# Altium project RGV_PCBA_1V21.PrjPcb (part 2 of 2)

## Sheet 9_USB_Connectors.SchDoc: Apalis Evaluation Board 1.1
size A3; Organization: Toradex AG; Address1: Altsagenstrasse 5; Address2: Horw; Address3: 6048; Address4: Switzerland; DocumentNumber: 7; Revision: V1.1; SheetNumber: 7; SheetTotal: 32; PageSetup: Record=PageOptions|CenterHorizontal=True|CenterVertical=True|PrintScale=0.71|XCorrection=1.00|YCorrection=1.00|PrintKind=0|BorderSize=5000000|LeftOffset=0|BottomOffset=0|Orientation=2|PaperLength=1000|PaperWidth=1000|Scale=100|PaperSource=7|PrintQuality=-4|MediaType=1|DitherType=10|PaperKind=A4|PrintScaleMode=1
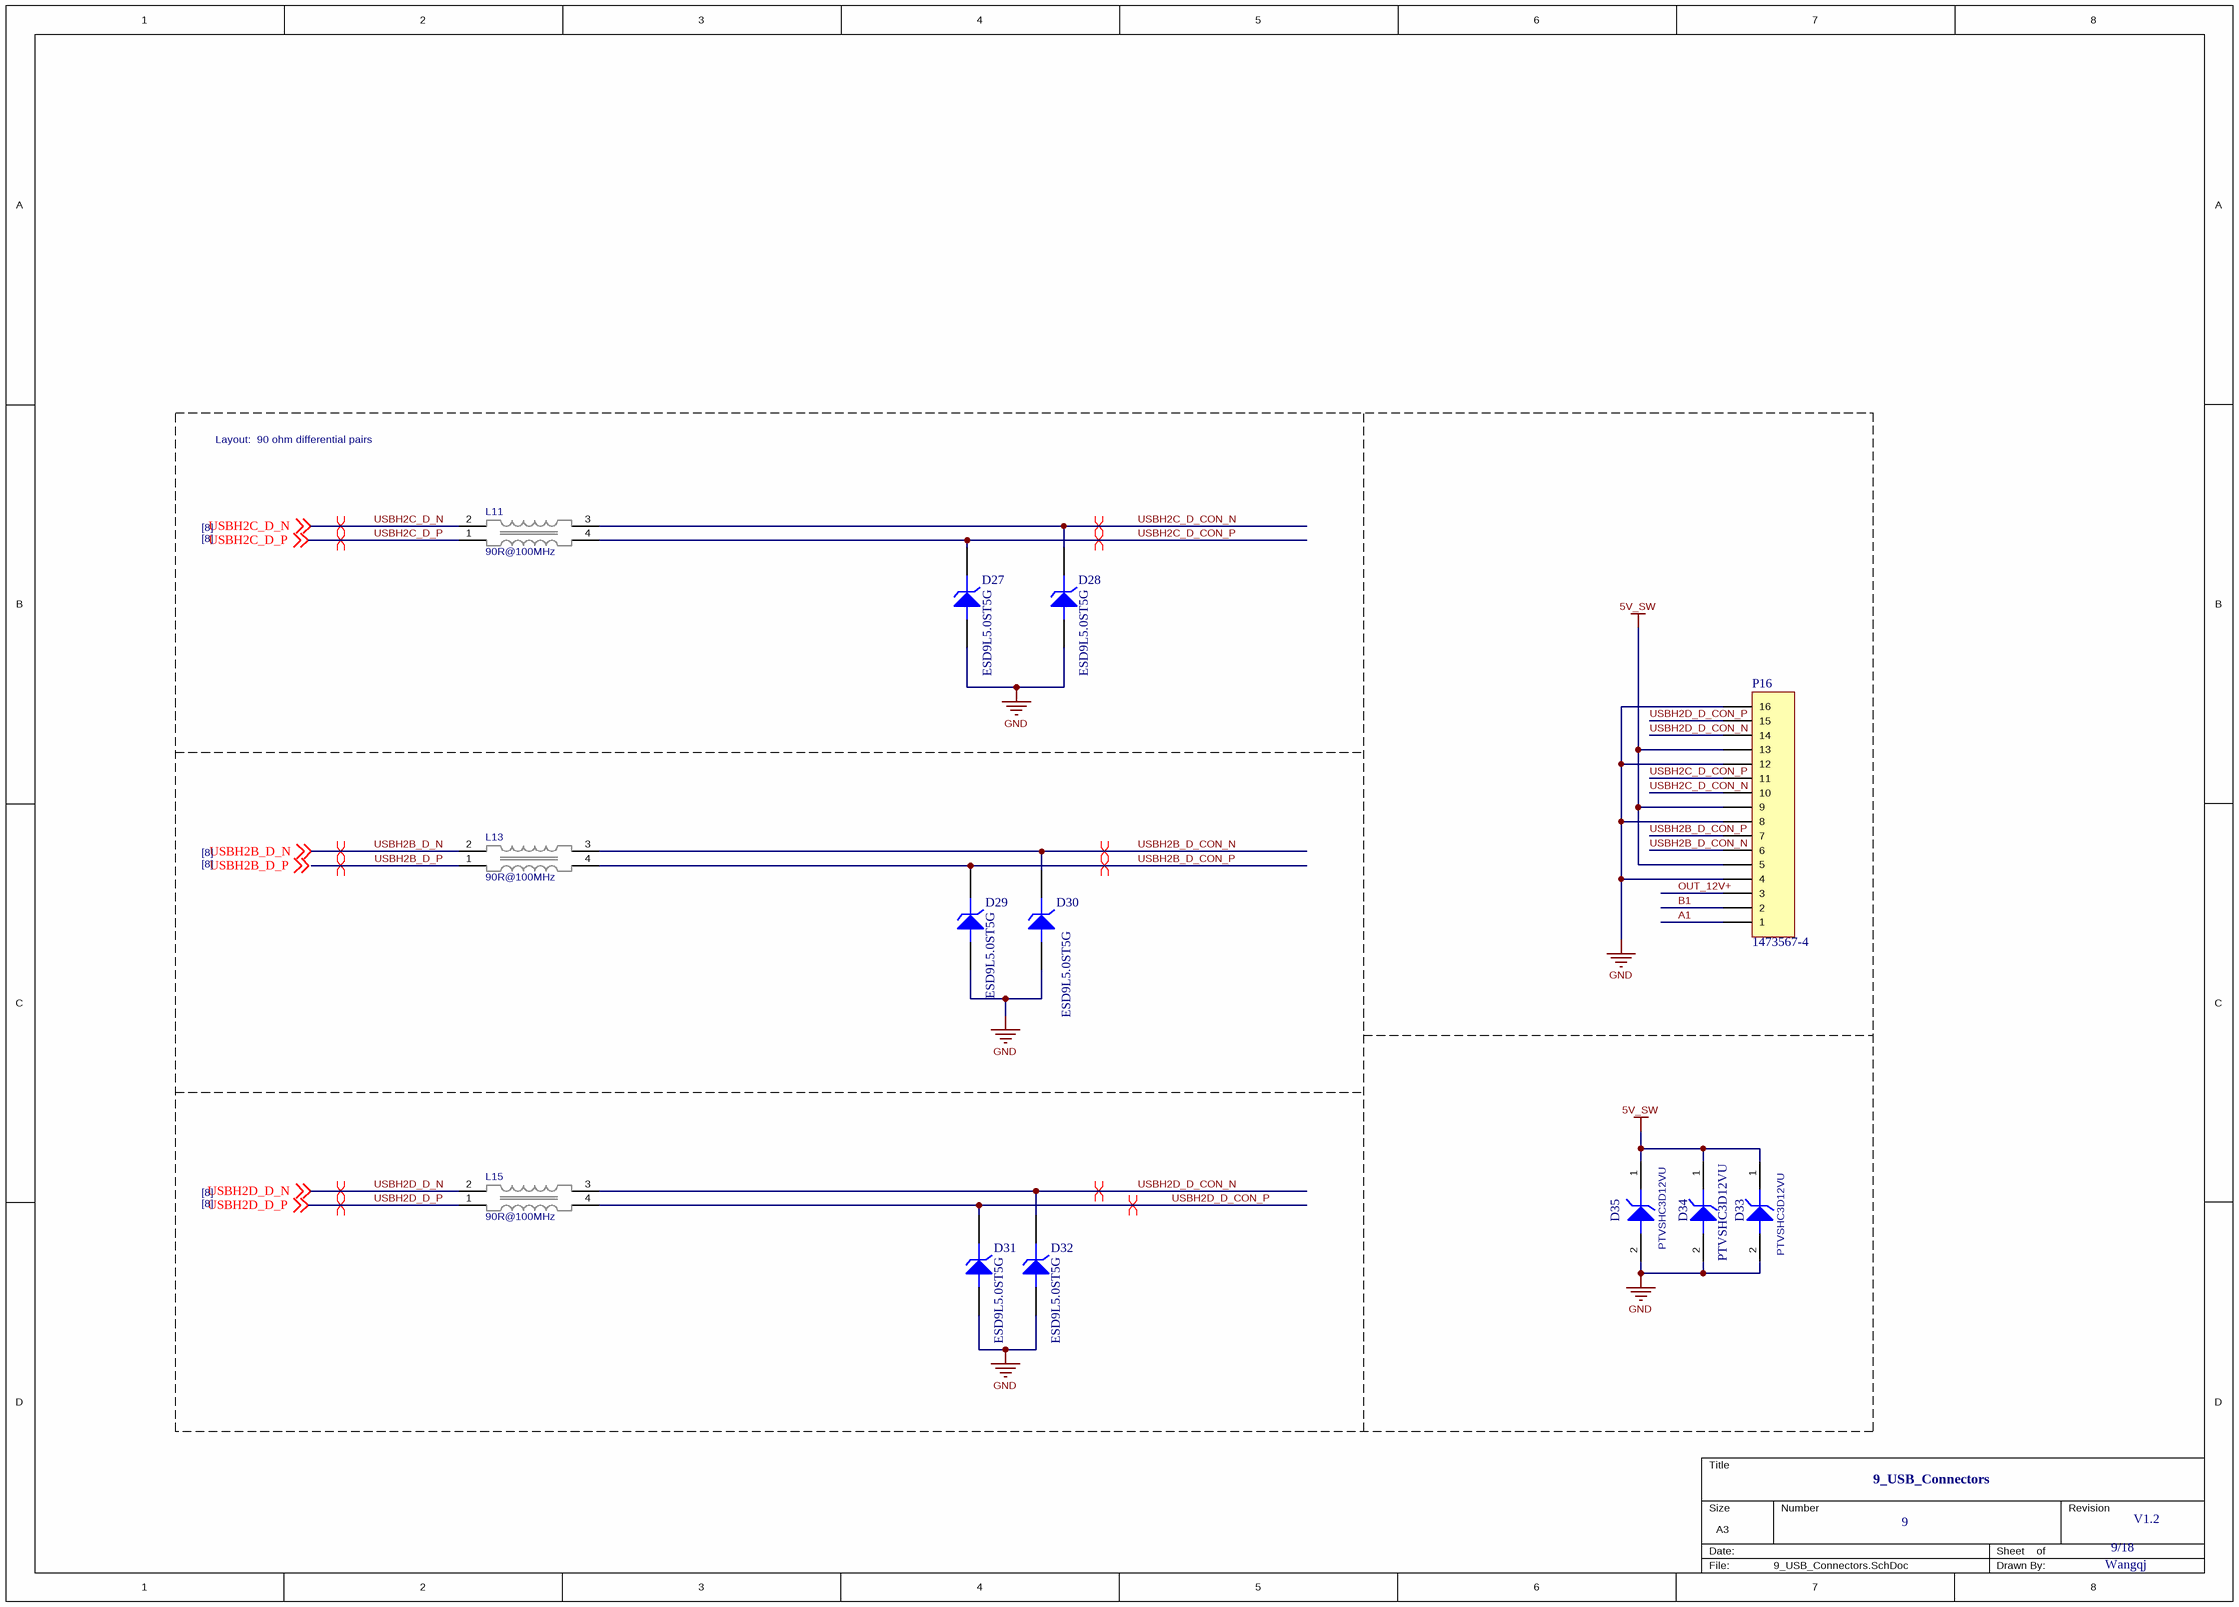
[diagram p8: 9_USB_Connectors.SchDoc]

### Parts
D27  ESD9L5.0ST5G  [LC-SOD-923]
D28  ESD9L5.0ST5G  [LC-SOD-923]
D29  ESD9L5.0ST5G  [LC-SOD-923]
D30  ESD9L5.0ST5G  [LC-SOD-923]
D31  ESD9L5.0ST5G  [LC-SOD-923]
D32  ESD9L5.0ST5G  [LC-SOD-923]
D33  PTVSHC3D12VU  [LC-SOD-323]
D34  PTVSHC3D12VU  [LC-SOD-323]
D35  PTVSHC3D12VU  [LC-SOD-323]
L11  90R@100MHz  [T_Murata_DLW21SN900SQ2]
L13  90R@100MHz  [T_Murata_DLW21SN900SQ2]
L15  90R@100MHz  [T_Murata_DLW21SN900SQ2]
P16  1473567-4  [147-4]

### Nets
5V_SW: D33.1(K) D34.1(K) D35.1(K) P16.5 P16.9 P16.13
GND: D27.1(A) D28.1(A) D29.1(A) D30.1(A) D31.1(A) D32.1(A) D33.2(A) D34.2(A) D35.2(A) P16.4 P16.8 P16.12 P16.16
OUT_12V+: P16.3
A1: P16.1
B1: P16.2
USBH2B_D_CON_N: D30.2(K) L13.3 P16.6
USBH2B_D_CON_P: D29.2(K) L13.4 P16.7
USBH2B_D_N: L13.2 ; off-sheet USBH2B_D_N
USBH2B_D_P: L13.1 ; off-sheet USBH2B_D_P
USBH2C_D_CON_N: D28.2(K) L11.3 P16.10
USBH2C_D_CON_P: D27.2(K) L11.4 P16.11
USBH2C_D_N: L11.2 ; off-sheet USBH2C_D_N
USBH2C_D_P: L11.1 ; off-sheet USBH2C_D_P
USBH2D_D_CON_N: D32.2(K) L15.3 P16.14
USBH2D_D_CON_P: D31.2(K) L15.4 P16.15
USBH2D_D_N: L15.2 ; off-sheet USBH2D_D_N
USBH2D_D_P: L15.1 ; off-sheet USBH2D_D_P

### Layout directives
differential pair: USBH2B_D_CON_N, USBH2B_D_CON_P, USBH2B_D_N, USBH2B_D_P, USBH2C_D_CON_N, USBH2C_D_CON_P, USBH2C_D_N, USBH2C_D_P, USBH2D_D_CON_N, USBH2D_D_CON_P, USBH2D_D_N, USBH2D_D_P

### Notes on the sheet
- Layout:  90 ohm differential pairs
- [8]
- 9_USB_Connectors
- 9
- 9/18
- V1.2
- Wangqj
- Labels drawn without touching a wire or pin: USBH2B_D_P
- Title
- Size:
- Date:
- A3
- Number:
- Time:
- Revision:
- Sheet
- of
- File:

### Library data of the parts
D27-D32 = ZENER3: TVS Diode
D33-D35 = Diode_TVS: TVS Diode
L11 L13 L15 = L-Murata-DLW21SN900SQ2-90R@100MHz-330mA-25%: Common Mode Choke High Speed 90R 330mA; Manufacturer Name: Murata; Tolerance: 25%; Rating: 330mA; Manufacturer Part No.: DLW21SN900SQ2; Value: 90R@100MHz
P16 = Header 16H: 泰科4p端子; LatestRevisionDate: 17-Jul-2002; LatestRevisionNote: Re-released for DXP Platform.; Publisher: Altium Limited

## Sheet 10_RS232_1.SchDoc
size A3
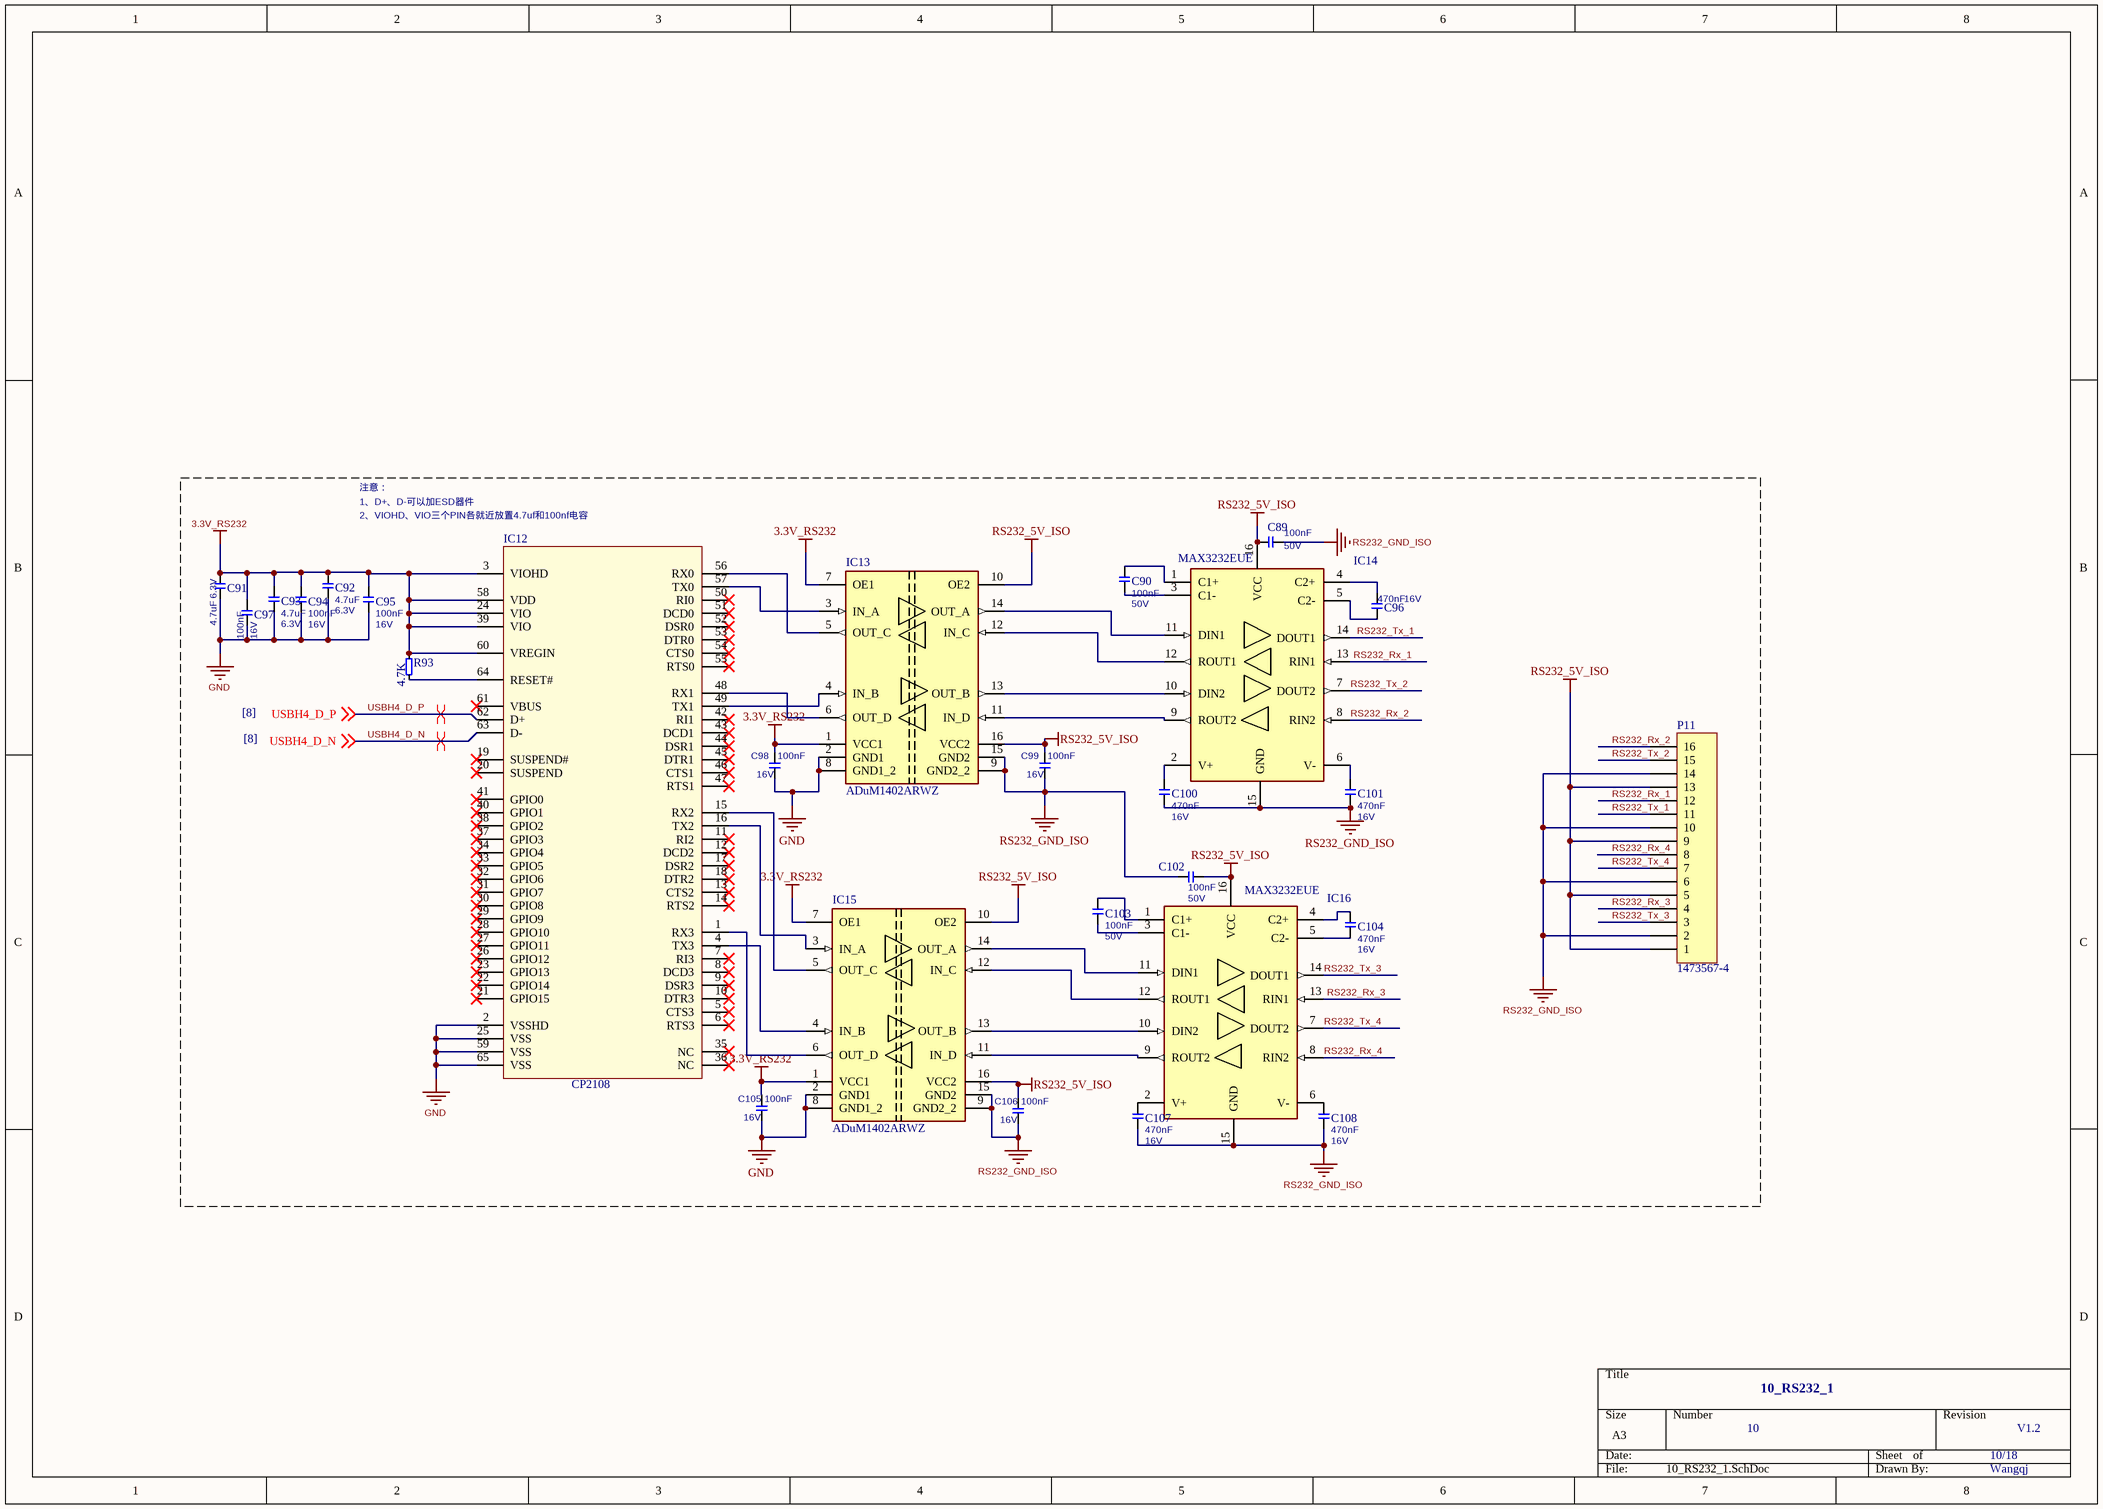
[diagram p9: 10_RS232_1.SchDoc]

### Parts
C89  Rating: 50V  [T_CAPC0603X33N]  (hidden comment: 100nF)
C90  Rating: 50V  [T_CAPC0603X33N]  (hidden comment: 100nF)
C91  Rating: 6.3V  [T_CAPC0603X33N]  (hidden comment: 4.7uF)
C92  Rating: 6.3V  [T_CAPC0603X33N]  (hidden comment: 4.7uF)
C93  Rating: 6.3V  [T_CAPC0603X33N]  (hidden comment: 4.7uF)
C94  Rating: 16V  [T_CAPC0603X33N]  (hidden comment: 100nF)
C95  Rating: 16V  [T_CAPC0603X33N]  (hidden comment: 100nF)
C96  Rating: 16V  [T_CAPC0603X33N]  (hidden comment: 470nF)
C97  Rating: 16V  [T_CAPC0603X33N]  (hidden comment: 100nF)
C98  Rating: 16V  [T_CAPC0603X33N]  (hidden comment: 100nF)
C99  Rating: 16V  [T_CAPC0603X33N]  (hidden comment: 100nF)
C100  Rating: 16V  [T_CAPC0603X33N]  (hidden comment: 470nF)
C101  Rating: 16V  [T_CAPC0603X33N]  (hidden comment: 470nF)
C102  Rating: 50V  [T_CAPC0603X33N]  (hidden comment: 100nF)
C103  Rating: 50V  [T_CAPC0603X33N]  (hidden comment: 100nF)
C104  Rating: 16V  [T_CAPC0603X33N]  (hidden comment: 470nF)
C105  Rating: 16V  [T_CAPC0603X33N]  (hidden comment: 100nF)
C106  Rating: 16V  [T_CAPC0603X33N]  (hidden comment: 100nF)
C107  Rating: 16V  [T_CAPC0603X33N]  (hidden comment: 470nF)
C108  Rating: 16V  [T_CAPC0603X33N]  (hidden comment: 470nF)
IC12  CP2108  [QFN50P900X900X90_HS-65N]
IC13  ADuM1402ARWZ  [T_AD_ADuM1300ARW]
IC14  MAX3232EUE  [LC-TSSOP-16]
IC15  ADuM1402ARWZ  [T_AD_ADuM1300ARW]
IC16  MAX3232EUE  [LC-TSSOP-16]
P11  1473567-4  [147-4]
R93  4.7K  [t_RESC0603X30N]

### Nets
3.3V_RS232: C91.2 C92.2 C93.2 C94.2 C95.2 C97.2 C98.2 C105.2 IC12.3(VIOHD) IC12.24(VIO) IC12.39(VIO) IC12.58(VDD) IC12.60(VREGIN) IC13.1(VCC1) IC13.7(OE1) IC15.1(VCC1) IC15.7(OE1) R93.2
GND: C91.1 C92.1 C93.1 C94.1 C95.1 C97.1 C98.1 C105.1 IC12.2(VSSHD) IC12.25(VSS) IC12.59(VSS) IC12.65(VSS) IC13.2(GND1) IC13.8(GND1_2) IC15.2(GND1) IC15.8(GND1_2)
RS232_5V_ISO: C89.2 C99.2 C102.1 C106.2 IC13.10(OE2) IC13.16(VCC2) IC14.16(VCC) IC15.10(OE2) IC15.16(VCC2) IC16.16(VCC) P11.1 P11.5 P11.9 P11.13
RS232_GND_ISO: C89.1 C99.1 C100.1 C101.1 C102.2 C106.1 C107.1 C108.1 IC13.9(GND2_2) IC13.15(GND2) IC14.15(GND) IC15.9(GND2_2) IC15.15(GND2) IC16.15(GND) P11.2 P11.6 P11.10 P11.14
RS232_Rx_1: IC14.13(RIN1) P11.12
RS232_Rx_2: IC14.8(RIN2) P11.16
RS232_Rx_3: IC16.13(RIN1) P11.4
RS232_Rx_4: IC16.8(RIN2) P11.8
RS232_Tx_1: IC14.14(DOUT1) P11.11
RS232_Tx_2: IC14.7(DOUT2) P11.15
RS232_Tx_3: IC16.14(DOUT1) P11.3
RS232_Tx_4: IC16.7(DOUT2) P11.7
USBH4_D_N: IC12.63(D-) ; off-sheet USBH4_D_N
USBH4_D_P: IC12.62(D+) ; off-sheet USBH4_D_P
NetC90_1: C90.1 IC14.3(C1-)
NetC90_2: C90.2 IC14.1(C1+)
NetC96_1: C96.1 IC14.5(C2-)
NetC96_2: C96.2 IC14.4(C2+)
NetC100_2: C100.2 IC14.2(V+)
NetC101_2: C101.2 IC14.6(V-)
NetC103_1: C103.1 IC16.3(C1-)
NetC103_2: C103.2 IC16.1(C1+)
NetC104_1: C104.1 IC16.5(C2-)
NetC104_2: C104.2 IC16.4(C2+)
NetC107_2: C107.2 IC16.2(V+)
NetC108_2: C108.2 IC16.6(V-)
NetIC12_1: IC12.1(RX3) IC15.6(OUT_D)
NetIC12_4: IC12.4(TX3) IC15.4(IN_B)
NetIC12_15: IC12.15(RX2) IC15.5(OUT_C)
NetIC12_16: IC12.16(TX2) IC15.3(IN_A)
NetIC12_48: IC12.48(RX1) IC13.6(OUT_D)
NetIC12_49: IC12.49(TX1) IC13.4(IN_B)
NetIC12_56: IC12.56(RX0) IC13.5(OUT_C)
NetIC12_57: IC12.57(TX0) IC13.3(IN_A)
NetIC12_64: IC12.64(RESET#) R93.1
NetIC13_11: IC13.11(IN_D) IC14.9(ROUT2)
NetIC13_12: IC13.12(IN_C) IC14.12(ROUT1)
NetIC13_13: IC13.13(OUT_B) IC14.10(DIN2)
NetIC13_14: IC13.14(OUT_A) IC14.11(DIN1)
NetIC15_11: IC15.11(IN_D) IC16.9(ROUT2)
NetIC15_12: IC15.12(IN_C) IC16.12(ROUT1)
NetIC15_13: IC15.13(OUT_B) IC16.10(DIN2)
NetIC15_14: IC15.14(OUT_A) IC16.11(DIN1)

Not connected (* = marked no-connect by the designer): IC12 5(CTS3)* 6(RTS3)* 7(RI3)* 8(DCD3)* 9(DSR3)* 10(DTR3)* 11(RI2)* 12(DCD2)* 13(CTS2)* 14(RTS2)* 17(DSR2)* 18(DTR2)* 19(SUSPEND#)* 20(SUSPEND)* 21(GPIO15)* 22(GPIO14)* 23(GPIO13)* 26(GPIO12)* 27(GPIO11)* 28(GPIO10)* 29(GPIO9)* 30(GPIO8)* 31(GPIO7)* 32(GPIO6)* 33(GPIO5)* 34(GPIO4)* 35(NC)* 36(NC)* 37(GPIO3)* 38(GPIO2)* 40(GPIO1)* 41(GPIO0)* 42(RI1)* 43(DCD1)* 44(DSR1)* 45(DTR1)* 46(CTS1)* 47(RTS1)* 50(RI0)* 51(DCD0)* 52(DSR0)* 53(DTR0)* 54(CTS0)* 55(RTS0)* 61(VBUS)*

### Layout directives
differential pair: USBH4_D_N, USBH4_D_P

### Notes on the sheet
- 注意：
- 1、D+、D-可以加ESD器件
- 2、VIOHD、VIO三个PIN各就近放置4.7uf和100nf电容
- [8]
- 10_RS232_1
- 10
- 10/18
- V1.2
- Wangqj

### Library data of the parts
C89 C90 C102 C103 = C-X7R-100nF-50V-20%-0603: Capacitor Ceramic X7R 100nF 50V 20% 0603; Tolerance: 20%; Type: X7R; Value: 100nF
C91-C93 = C-4.7uF-6.3V-20%-0603-X5R: Capacitor Ceramic X5R 4.7uF 6.3V 20% 0603; Tolerance: 20%; Type: X5R; Value: 4.7uF
C94 C95 C97 = C-100nF-16V-10%-0603-X7R: Capacitor Ceramic X7R 100nF 16V 10% 0603; Tolerance: 10%; Type: X7R; Value: 100nF
C96 C100 C101 C104 C107 C108 = C-X7R-470nF-16V-10%-0603: Capacitor Ceramic X7R 470nF 16V 10% 0603; Type: X7R; Tolerance: 10%; Value: 470nF
C98 C99 C105 C106 = C-X7R-100nF-16V-10%-0603: Capacitor Ceramic X7R 100nF 16V 10% 0603; Tolerance: 10%; Type: X7R; Value: 100nF
IC12 = IC-SILICON-CP2108: Single-Chip USB To Quad UART Bridge; Manufacturer Name: SILICON LABS; Manucfacturer Part NO.: CP2108
IC13 IC15 = IC-AD-ADuM1402ARWZ: Digital Isolator
IC14 IC16 = IC-MAXIM-MAX3232: RS232
P11 = MHDR1X16: 泰科4P端子; LatestRevisionDate: 17-Jul-2002; LatestRevisionNote: Re-released for DXP Platform.; Publisher: Altium Limited
R93 = R-4.7kR-63mW-5%-0603: Resistor 4.7 Kohm 63mW 5% 0603; Value: 4.7KR; Rating: 63mW; Tolerance: 5%

## Sheet 11_RS232_2.SchDoc
size A3
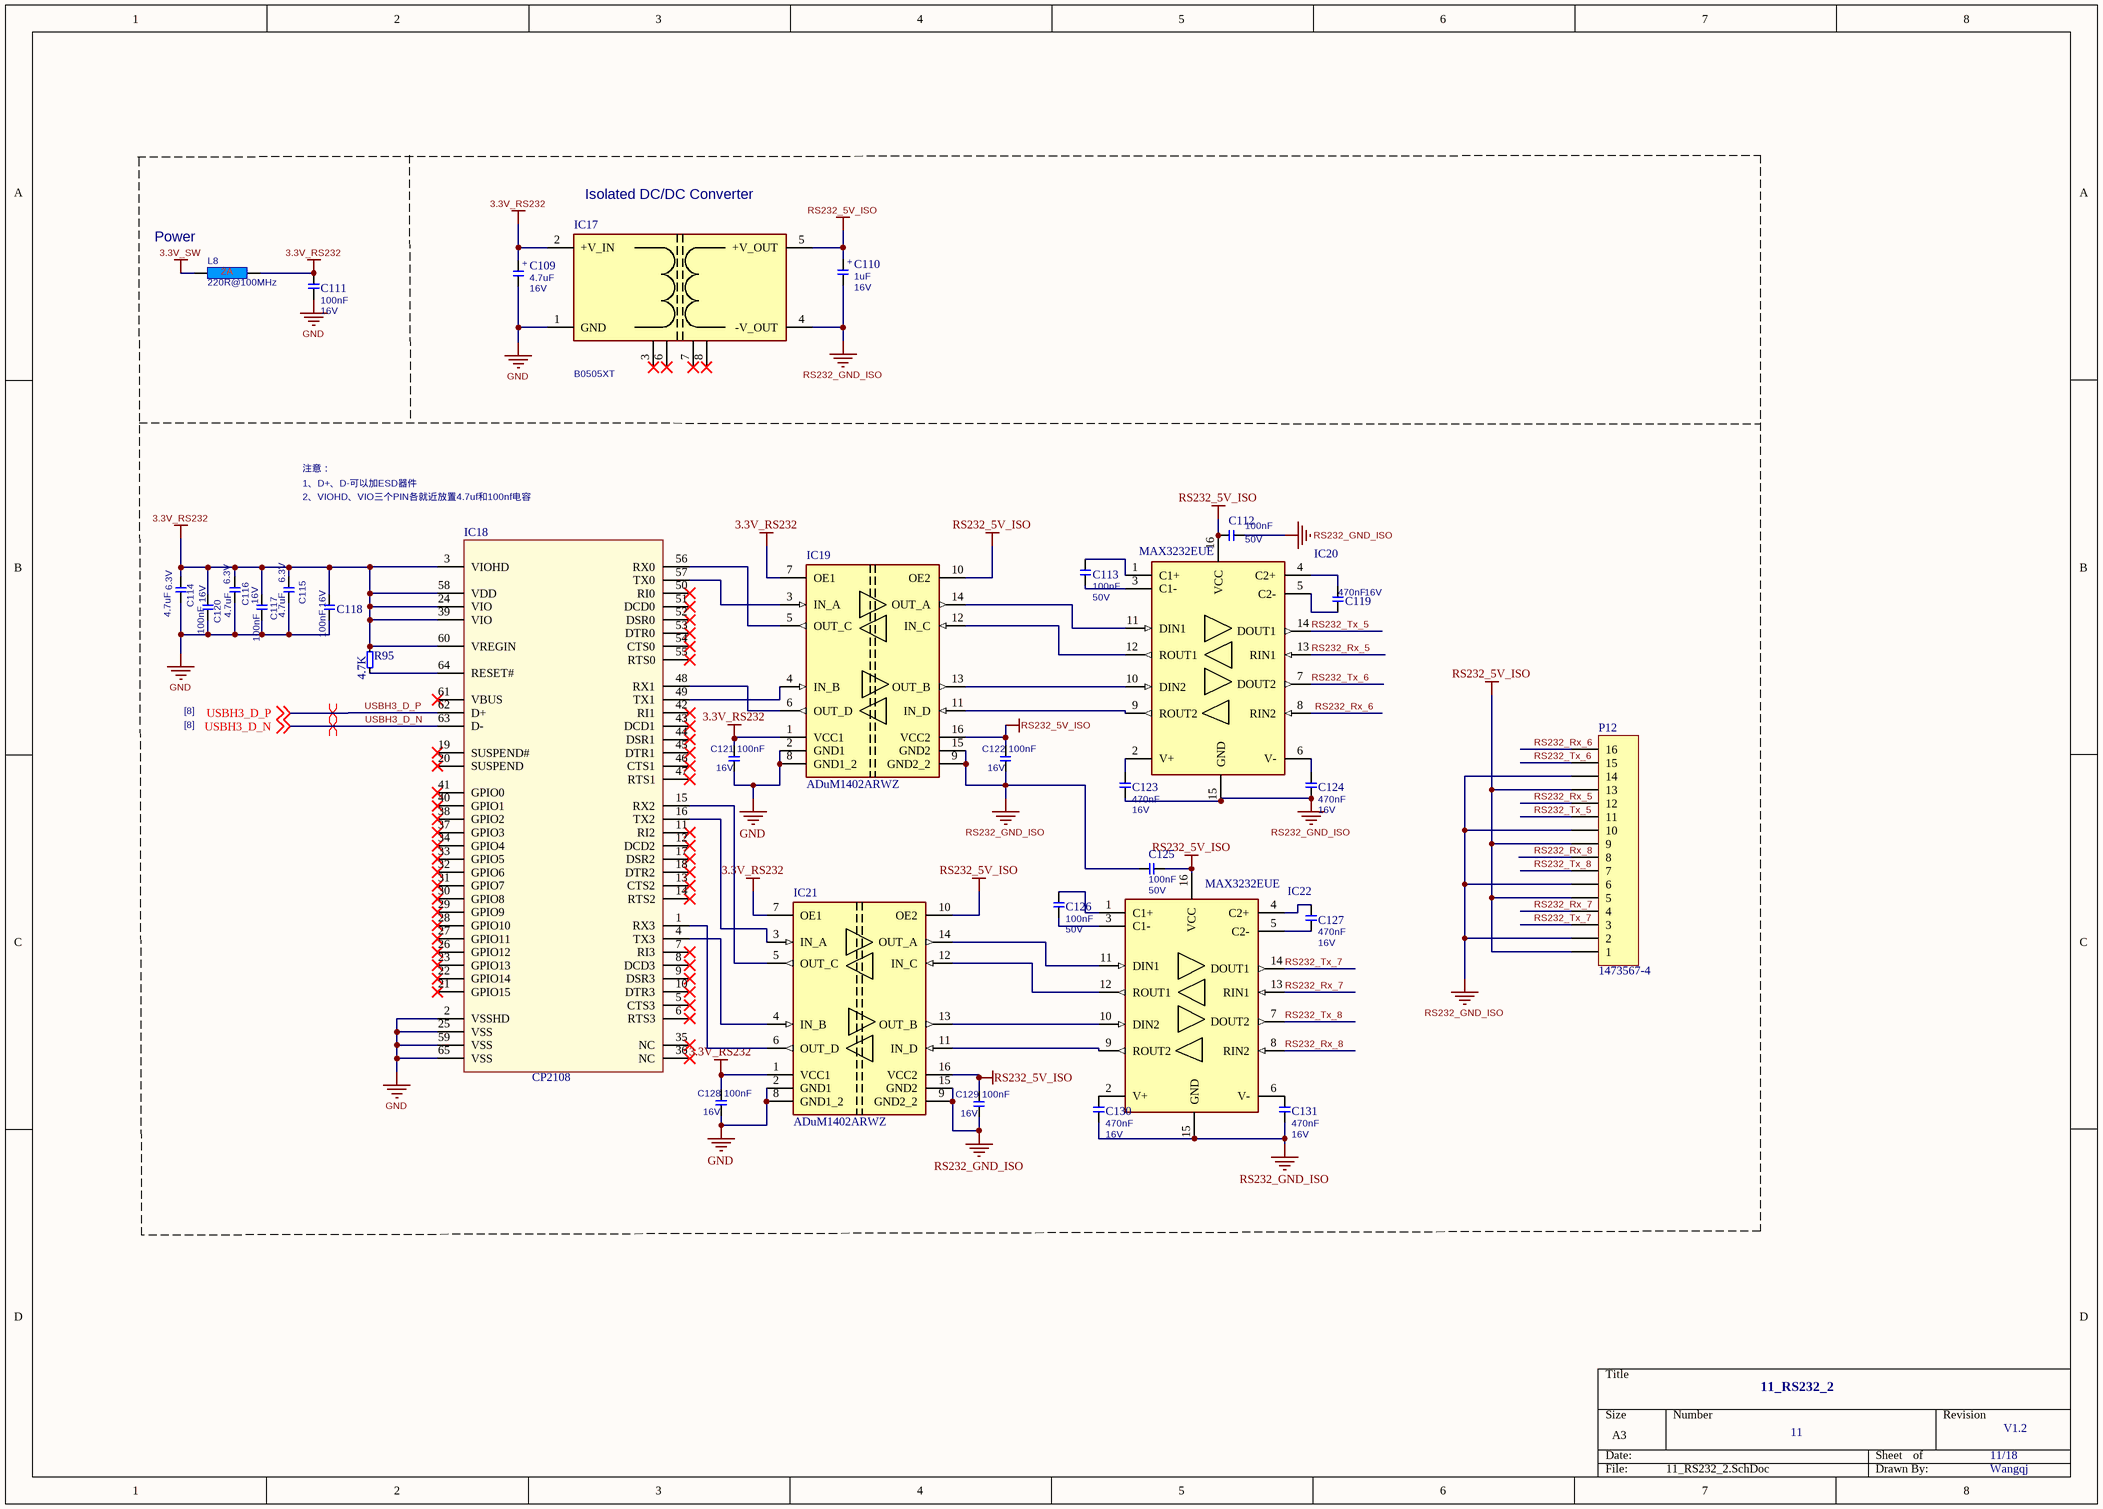
[diagram p10: 11_RS232_2.SchDoc]

### Parts
C109  Rating: 16V  [T_CAPMP3216X180N]  (hidden comment: 4.7uF)
C110  Rating: 16V  [T_CAPMP3216X180N]  (hidden comment: 1uF)
C111  Rating: 16V  [T_CAPC0603X33N]  (hidden comment: 100nF)
C112  Rating: 50V  [T_CAPC0603X33N]  (hidden comment: 100nF)
C113  Rating: 50V  [T_CAPC0603X33N]  (hidden comment: 100nF)
C114  Rating: 6.3V  [T_CAPC0603X33N]  (hidden comment: 4.7uF)
C115  Rating: 6.3V  [T_CAPC0603X33N]  (hidden comment: 4.7uF)
C116  Rating: 6.3V  [T_CAPC0603X33N]  (hidden comment: 4.7uF)
C117  Rating: 16V  [T_CAPC0603X33N]  (hidden comment: 100nF)
C118  Rating: 16V  [T_CAPC0603X33N]  (hidden comment: 100nF)
C119  Rating: 16V  [T_CAPC0603X33N]  (hidden comment: 470nF)
C120  Rating: 16V  [T_CAPC0603X33N]  (hidden comment: 100nF)
C121  Rating: 16V  [T_CAPC0603X33N]  (hidden comment: 100nF)
C122  Rating: 16V  [T_CAPC0603X33N]  (hidden comment: 100nF)
C123  Rating: 16V  [T_CAPC0603X33N]  (hidden comment: 470nF)
C124  Rating: 16V  [T_CAPC0603X33N]  (hidden comment: 470nF)
C125  Rating: 50V  [T_CAPC0603X33N]  (hidden comment: 100nF)
C126  Rating: 50V  [T_CAPC0603X33N]  (hidden comment: 100nF)
C127  Rating: 16V  [T_CAPC0603X33N]  (hidden comment: 470nF)
C128  Rating: 16V  [T_CAPC0603X33N]  (hidden comment: 100nF)
C129  Rating: 16V  [T_CAPC0603X33N]  (hidden comment: 100nF)
C130  Rating: 16V  [T_CAPC0603X33N]  (hidden comment: 470nF)
C131  Rating: 16V  [T_CAPC0603X33N]  (hidden comment: 470nF)
IC17  Manufacturer Part No.: B0505XT  [MORNSUN_B0305XT-1W_SMD]  (hidden comment: B0505XT-1W)
IC18  CP2108  [QFN50P900X900X90_HS-65N]
IC19  ADuM1402ARWZ  [T_AD_ADuM1300ARW]
IC20  MAX3232EUE  [LC-TSSOP-16]
IC21  ADuM1402ARWZ  [T_AD_ADuM1300ARW]
IC22  MAX3232EUE  [LC-TSSOP-16]
L8  220R@100MHz  [INDC1608X95N]
P12  1473567-4  [147-4]
R95  4.7K  [t_RESC0603X30N]

### Nets
3.3V_RS232: C109.1 C111.2 C114.2 C115.2 C116.2 C117.2 C118.2 C120.2 C121.2 C128.2 IC17.2(+V_IN) IC18.3(VIOHD) IC18.24(VIO) IC18.39(VIO) IC18.58(VDD) IC18.60(VREGIN) IC19.1(VCC1) IC19.7(OE1) IC21.1(VCC1) IC21.7(OE1) L8.2 R95.2
3.3V_SW: L8.1
GND: C109.2 C111.1 C114.1 C115.1 C116.1 C117.1 C118.1 C120.1 C121.1 C128.1 IC17.1(GND) IC18.2(VSSHD) IC18.25(VSS) IC18.59(VSS) IC18.65(VSS) IC19.2(GND1) IC19.8(GND1_2) IC21.2(GND1) IC21.8(GND1_2)
RS232_5V_ISO: C110.1 C112.2 C122.2 C125.1 C129.2 IC17.5(+V_OUT) IC19.10(OE2) IC19.16(VCC2) IC20.16(VCC) IC21.10(OE2) IC21.16(VCC2) IC22.16(VCC) P12.1 P12.5 P12.9 P12.13
RS232_GND_ISO: C110.2 C112.1 C122.1 C123.1 C124.1 C125.2 C129.1 C130.1 C131.1 IC17.4(-V_OUT) IC19.9(GND2_2) IC19.15(GND2) IC20.15(GND) IC21.9(GND2_2) IC21.15(GND2) IC22.15(GND) P12.2 P12.6 P12.10 P12.14
RS232_Rx_5: IC20.13(RIN1) P12.12
RS232_Rx_6: IC20.8(RIN2) P12.16
RS232_Rx_7: IC22.13(RIN1) P12.4
RS232_Rx_8: IC22.8(RIN2) P12.8
RS232_Tx_5: IC20.14(DOUT1) P12.11
RS232_Tx_6: IC20.7(DOUT2) P12.15
RS232_Tx_7: IC22.14(DOUT1) P12.3
RS232_Tx_8: IC22.7(DOUT2) P12.7
USBH3_D_N: IC18.63(D-) ; off-sheet USBH3_D_N
USBH3_D_P: IC18.62(D+) ; off-sheet USBH3_D_P
NetC113_1: C113.1 IC20.3(C1-)
NetC113_2: C113.2 IC20.1(C1+)
NetC119_1: C119.1 IC20.5(C2-)
NetC119_2: C119.2 IC20.4(C2+)
NetC123_2: C123.2 IC20.2(V+)
NetC124_2: C124.2 IC20.6(V-)
NetC126_1: C126.1 IC22.3(C1-)
NetC126_2: C126.2 IC22.1(C1+)
NetC127_1: C127.1 IC22.5(C2-)
NetC127_2: C127.2 IC22.4(C2+)
NetC130_2: C130.2 IC22.2(V+)
NetC131_2: C131.2 IC22.6(V-)
NetIC18_1: IC18.1(RX3) IC21.6(OUT_D)
NetIC18_4: IC18.4(TX3) IC21.4(IN_B)
NetIC18_15: IC18.15(RX2) IC21.5(OUT_C)
NetIC18_16: IC18.16(TX2) IC21.3(IN_A)
NetIC18_48: IC18.48(RX1) IC19.6(OUT_D)
NetIC18_49: IC18.49(TX1) IC19.4(IN_B)
NetIC18_56: IC18.56(RX0) IC19.5(OUT_C)
NetIC18_57: IC18.57(TX0) IC19.3(IN_A)
NetIC18_64: IC18.64(RESET#) R95.1
NetIC19_11: IC19.11(IN_D) IC20.9(ROUT2)
NetIC19_12: IC19.12(IN_C) IC20.12(ROUT1)
NetIC19_13: IC19.13(OUT_B) IC20.10(DIN2)
NetIC19_14: IC19.14(OUT_A) IC20.11(DIN1)
NetIC21_11: IC21.11(IN_D) IC22.9(ROUT2)
NetIC21_12: IC21.12(IN_C) IC22.12(ROUT1)
NetIC21_13: IC21.13(OUT_B) IC22.10(DIN2)
NetIC21_14: IC21.14(OUT_A) IC22.11(DIN1)

Not connected (* = marked no-connect by the designer): IC17 3(NC)* 6(NC)* 7(NC)* 8(NC)*; IC18 5(CTS3)* 6(RTS3)* 7(RI3)* 8(DCD3)* 9(DSR3)* 10(DTR3)* 11(RI2)* 12(DCD2)* 13(CTS2)* 14(RTS2)* 17(DSR2)* 18(DTR2)* 19(SUSPEND#)* 20(SUSPEND)* 21(GPIO15)* 22(GPIO14)* 23(GPIO13)* 26(GPIO12)* 27(GPIO11)* 28(GPIO10)* 29(GPIO9)* 30(GPIO8)* 31(GPIO7)* 32(GPIO6)* 33(GPIO5)* 34(GPIO4)* 35(NC)* 36(NC)* 37(GPIO3)* 38(GPIO2)* 40(GPIO1)* 41(GPIO0)* 42(RI1)* 43(DCD1)* 44(DSR1)* 45(DTR1)* 46(CTS1)* 47(RTS1)* 50(RI0)* 51(DCD0)* 52(DSR0)* 53(DTR0)* 54(CTS0)* 55(RTS0)* 61(VBUS)*

### Layout directives
differential pair: USBH3_D_N, USBH3_D_P

### Notes on the sheet
- (near L8) Power
- (near IC17) Isolated DC/DC Converter
- 注意：
- 1、D+、D-可以加ESD器件
- 2、VIOHD、VIO三个PIN各就近放置4.7uf和100nf电容
- [8]
- 11_RS232_2
- 11
- 11/18
- V1.2
- Wangqj
- (in symbol C-1uF-16V-10%-3216-TA) +
- (in symbol C-4.7uF-16V-10%-3216-TA) +

### Library data of the parts
C109 = C-4.7uF-16V-10%-3216-TA: Capacitor TA 4.7uF 16V 10% 3216; Tolerance: 10%; Type: TA; Value: 4.7uF
C110 = C-1uF-16V-10%-3216-TA: Capacitor TA 1uF 16V 10% 3216; Tolerance: 10%; Type: TA; Value: 1uF
C111 C117 C118 C120 = C-100nF-16V-10%-0603-X7R: Capacitor Ceramic X7R 100nF 16V 10% 0603; Tolerance: 10%; Type: X7R; Value: 100nF
C112 C113 C125 C126 = C-X7R-100nF-50V-20%-0603: Capacitor Ceramic X7R 100nF 50V 20% 0603; Tolerance: 20%; Type: X7R; Value: 100nF
C114-C116 = C-4.7uF-6.3V-20%-0603-X5R: as C91 on sheet 10_RS232_1; Tolerance: 20%; Type: X5R; Value: 4.7uF
C119 C123 C124 C127 C130 C131 = C-X7R-470nF-16V-10%-0603: Capacitor Ceramic X7R 470nF 16V 10% 0603; Type: X7R; Tolerance: 10%; Value: 470nF
C121 C122 C128 C129 = C-X7R-100nF-16V-10%-0603: Capacitor Ceramic X7R 100nF 16V 10% 0603; Tolerance: 10%; Type: X7R; Value: 100nF
IC17 = IC-MORNSUN-B0505XT-SMD: MORNSUN Isolated DC/DC Converter; Manufacturer Name: Murata
IC18 = IC-SILICON-CP2108: as IC12 on sheet 10_RS232_1; Manucfacturer Part NO.: CP2108
IC19 IC21 = IC-AD-ADuM1402ARWZ: Digital Isolator
IC20 IC22 = IC-MAXIM-MAX3232: RS232
L8 = L-220R@100MHz-2A-25%-0603: 220R@100MHz 2A EMI FILTER; Tolerance: 25%; Rating: 2A; Value: 220R@100MHz
P12 = MHDR1X16: 泰科4P端子; LatestRevisionDate: 17-Jul-2002; LatestRevisionNote: Re-released for DXP Platform.; Publisher: Altium Limited
R95 = R-4.7kR-63mW-5%-0603: as R93 on sheet 10_RS232_1; Rating: 63mW; Tolerance: 5%

## Sheet 12_NB-IOT_Core.SchDoc
size A3
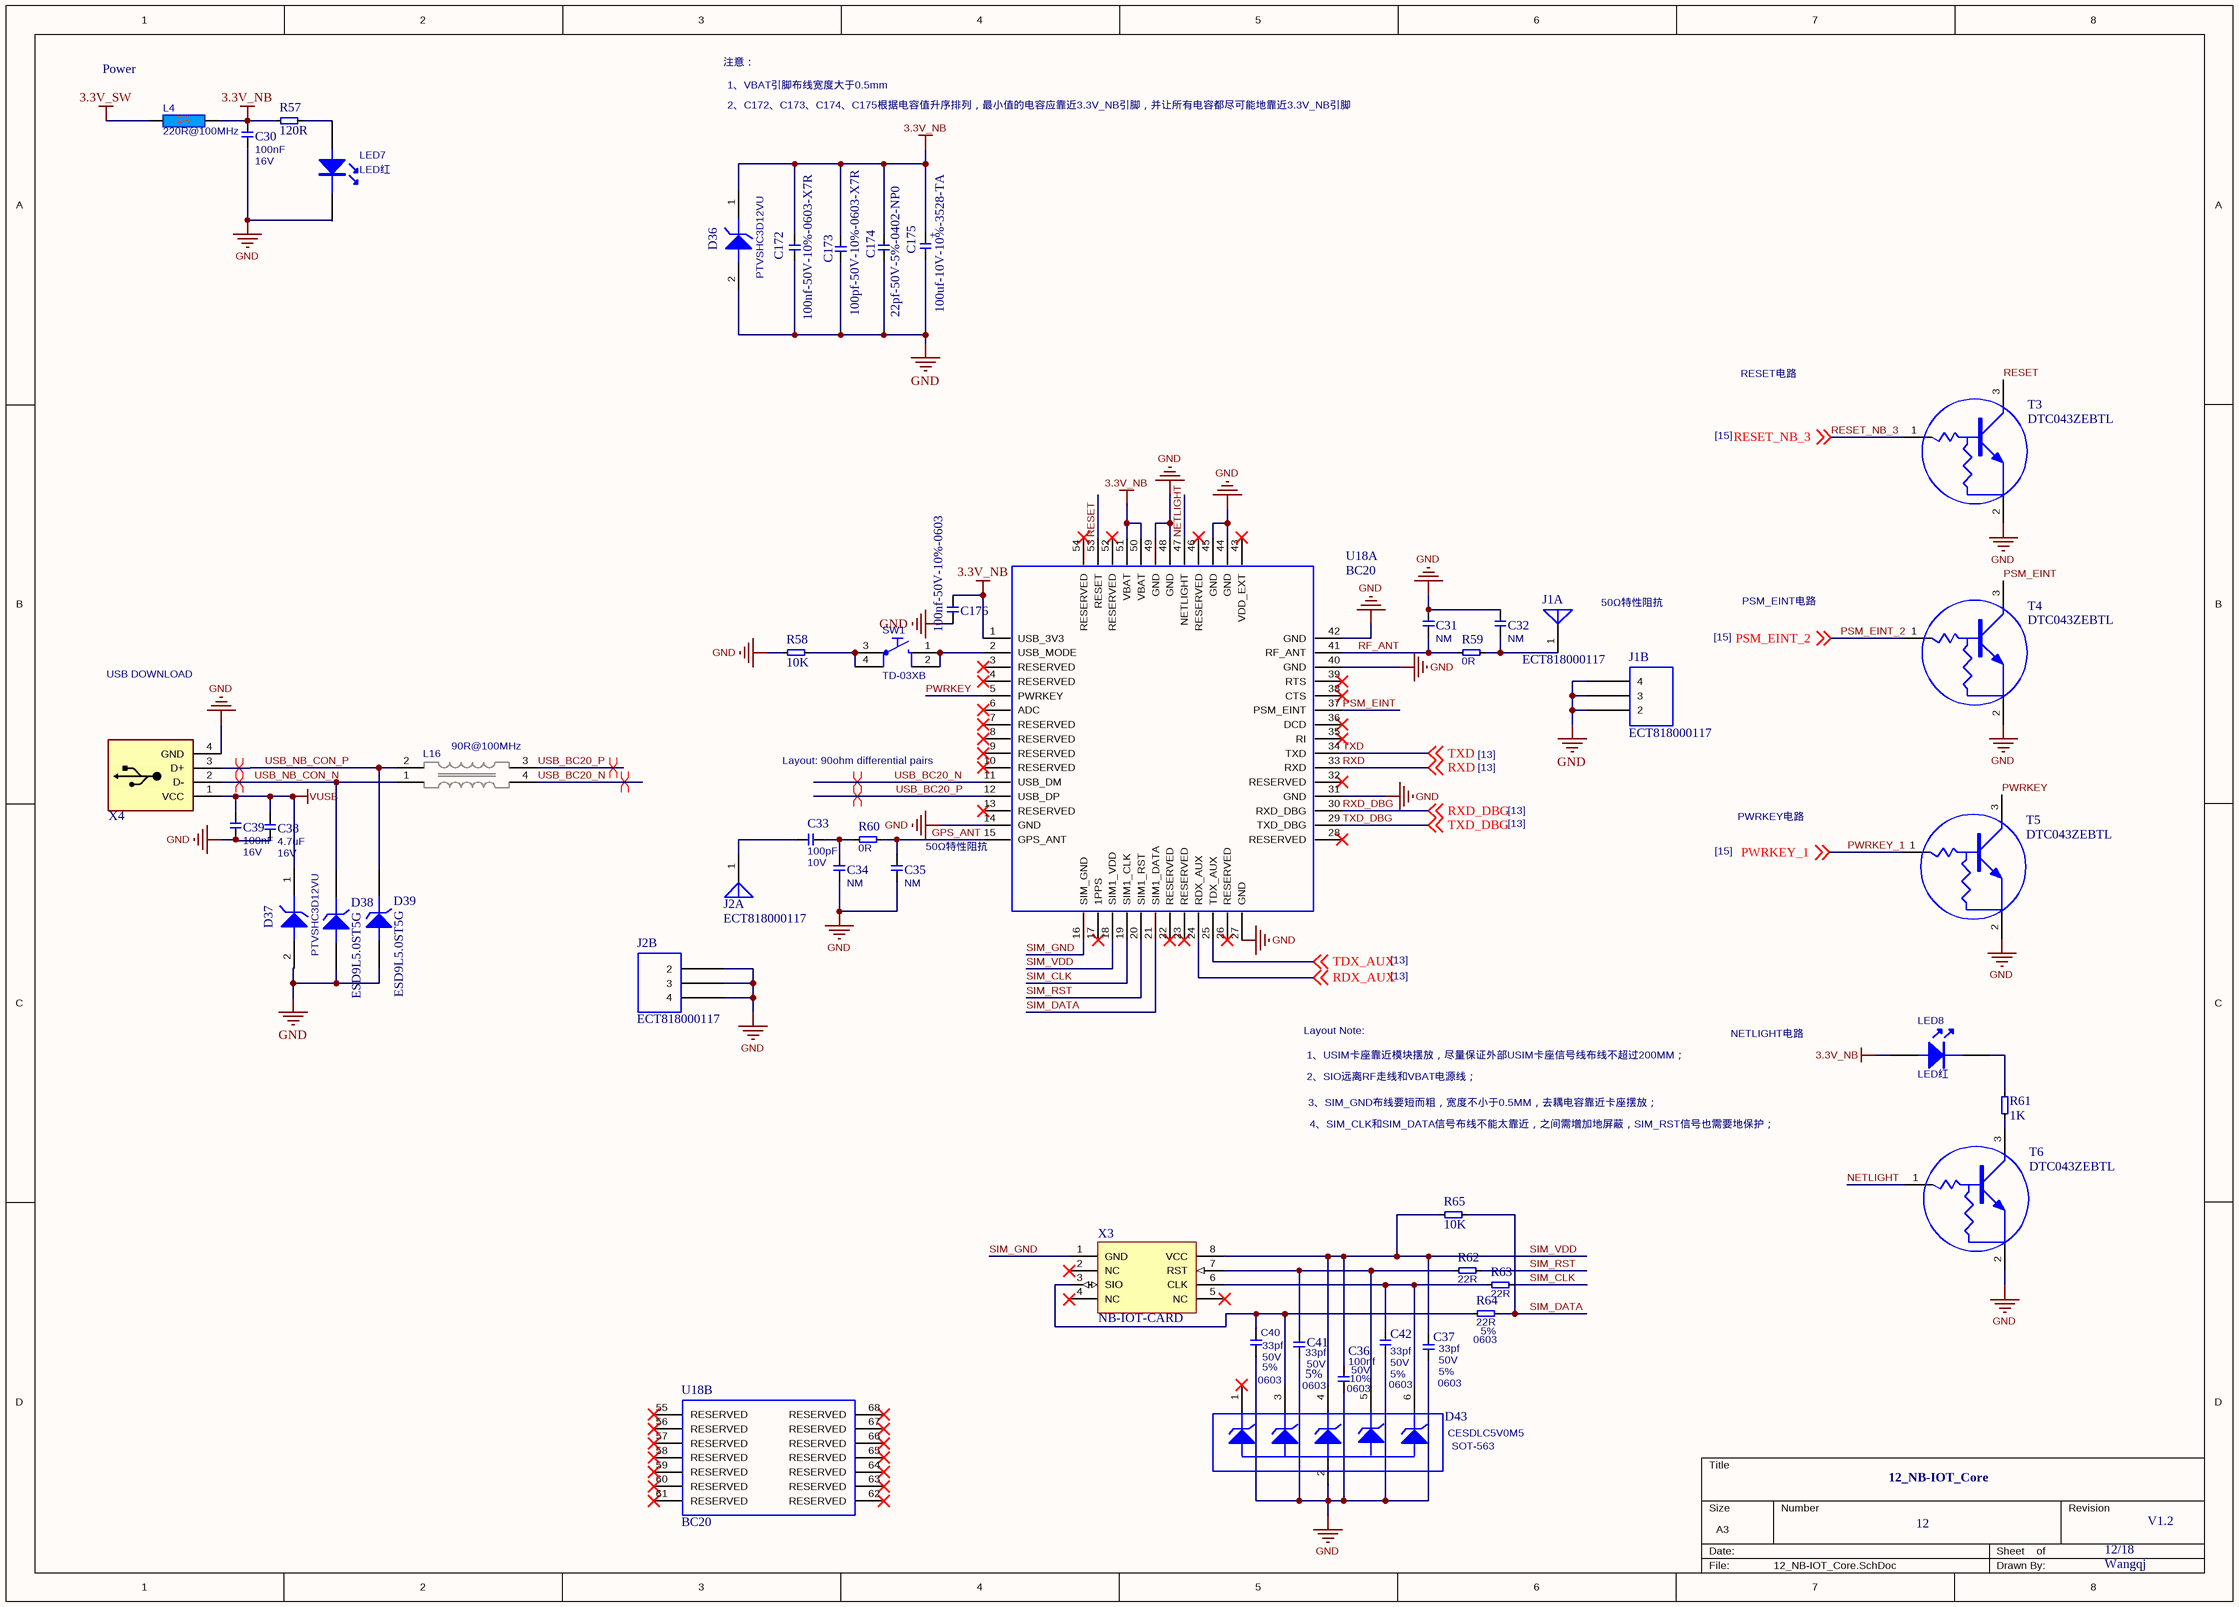
[diagram p11: 12_NB-IOT_Core.SchDoc]

### Parts
C30  Rating: 16V  [T_CAPC0603X33N]  (hidden comment: 100nF)
C31  NM  [T_CAPC0603X33N]
C32  NM  [T_CAPC0603X33N]
C33  Rating: 10V  [T_CAPC0603X33N]  (hidden comment: 100pF)
C34  NM  [T_CAPC0603X33N]
C35  NM  [T_CAPC0603X33N]
C36  value 100nf  Footprint: 0603  Rating: 50V  Tolerance: 10%  [CAPC0603]  (hidden comment: 0.1uf-50V-10%-0603)
C37  value 33pf  Tolerance: 5%  Rating: 50V  Footprint: 0603  [T_CAPC0603X33N]  (hidden comment: 33pf-50V-5%-0603)
C38  Rating: 16V  [T_CAPC0603X33N]  (hidden comment: 4.7uF)
C39  Rating: 16V  [T_CAPC0603X33N]  (hidden comment: 100nF)
C40  value 33pf  Tolerance: 5%  Rating: 50V  Footprint: 0603  [T_CAPC0603X33N]  (hidden comment: 33pf-50V-5%-0603)
C41  value 33pf  Tolerance: 5%  Rating: 50V  Footprint: 0603  [T_CAPC0603X33N]  (hidden comment: 33pf-50V-5%-0603)
C42  value 33pf  Tolerance: 5%  Rating: 50V  Footprint: 0603  [T_CAPC0603X33N]  (hidden comment: 33pf-50V-5%-0603)
C172  100nf-50V-10%-0603-X7R  [T_CAPC0603X33N]
C173  100pf-50V-10%-0603-X7R  [T_CAPC0603X33N]
C174  22pf-50V-5%-0402-NP0  [CAPC0402]
C175  100uf-10V-10%-3528-TA  [T_CAPMP3216X180N]
C176  100nf-50V-10%-0603  [T_CAPC0603X33N]
D36  PTVSHC3D12VU  [LC-SOD-323]
D37  PTVSHC3D12VU  [LC-SOD-323]
D38  ESD9L5.0ST5G  [LC-SOD-923]
D39  ESD9L5.0ST5G  [LC-SOD-923]
D43  CESDLC5V0M5  [SOT-563]
J1  ECT818000117  [IPEX2]  (parts A,B of 2)
J2  ECT818000117  [IPEX2]  (parts A,B of 2)
L4  220R@100MHz  [INDC1608X95N]
L16  90R@100MHz  [T_Murata_DLW21SN900SQ2]
LED7  LED红  [LC-0805_LED_S3]
LED8  LED红  [LC-0805_LED_S3]
R57  120R  [T_RESC0603X30N]
R58  10K  [T_RESC0603X30N]
R59  0R  [T_RESC0603X30N]
R60  0R  [T_RESC0603X30N]
R61  1K  [T_RESC0603X30N]
R62  22R  [T_RESC0603X30N]
R63  22R  [T_RESC0603X30N]
R64  value 22R  Tolerance: 5%  Footprint: 0603  [T_RESC0603X30N]  (hidden comment: 22R-5%-0603)
R65  10K  [T_RESC0603X30N]
SW1  TD-03XB  [T_WMF_TD-03XB]
T3  DTC043ZEBTL  [SOT-416FL]
T4  DTC043ZEBTL  [SOT-416FL]
T5  DTC043ZEBTL  [SOT-416FL]
T6  DTC043ZEBTL  [SOT-416FL]
U18  BC20  [BC20]  (parts A,B of 2)
X3  NB-IOT-CARD  [QFN127P600X500X90_HS-9N]
X4  CON-USB  [2.54*4p]  (value not drawn)

### Nets
3.3V_NB: C30.2 C172.2 C173.2 C174.2 C175.1 C176.1 D36.1(K) L4.2 LED8.A R57.1 U18.1(USB_3V3) U18.50(VBAT) U18.51(VBAT)
3.3V_SW: L4.1
GND: C30.1 C31.2 C32.2 C34.1 C35.1 C36.1 C37.2 C38.2 C39.2 C40.1 C41.1 C42.1 C172.1 C173.1 C174.1 C175.2 C176.2 D36.2(A) D37.2(A) D38.1(A) D39.1(A) D43.2(A) J1.2 J1.3 J1.4 J2.2 J2.3 J2.4 LED7.K R58.1 T3.2(E) T4.2(E) T5.2(E) T6.2(E) U18.14(GND) U18.27(GND) U18.31(GND) U18.40(GND) U18.42(GND) U18.44(GND) U18.45(GND) U18.48(GND) U18.49(GND) X4.4(GND)
VUSB: C38.1 C39.1 D37.1(K) X4.1(VCC)
GPS_ANT: C35.2 R60.2 U18.15(GPS_ANT)
NETLIGHT: T6.1(B) U18.47(NETLIGHT)
PSM_EINT: T4.3(C) U18.37(PSM_EINT)
PSM_EINT_2: T4.1(B) ; off-sheet PSM_EINT_2
PWRKEY: T5.3(C) U18.5(PWRKEY)
PWRKEY_1: T5.1(B) ; off-sheet PWRKEY_1
RDX_AUX: U18.24(RDX_AUX) ; off-sheet RDX_AUX
RESET: T3.3(C) U18.53(RESET)
RESET_NB_3: T3.1(B) ; off-sheet RESET_NB_3
RF_ANT: C31.1 R59.1 U18.41(RF_ANT)
RXD: U18.33(RXD) ; off-sheet RXD
RXD_DBG: U18.30(RXD_DBG) ; off-sheet RXD_DBG
SIM_CLK: R63.1 U18.19(SIM1_CLK)
SIM_DATA: R64.1 R65.2 U18.21(SIM1_DATA)
SIM_GND: U18.16(SIM_GND) X3.1(GND)
SIM_RST: R62.1 U18.20(SIM1_RST)
SIM_VDD: C36.2 C37.1 D43.4(K) R65.1 U18.18(SIM1_VDD) X3.8(VCC)
TDX_AUX: U18.25(TDX_AUX) ; off-sheet TDX_AUX
TXD: U18.34(TXD) ; off-sheet TXD
TXD_DBG: U18.29(TXD_DBG) ; off-sheet TXD_DBG
USB_BC20_N: L16.4 U18.11(USB_DM)
USB_BC20_P: L16.3 U18.12(USB_DP)
USB_NB_CON_N: D38.2(K) L16.1 X4.2(D-)
USB_NB_CON_P: D39.2(K) L16.2 X4.3(D+)
NetC32_1: C32.1 J1.1(A) R59.2
NetC33_1: C33.1 J2.1(A)
NetC33_2: C33.2 C34.2 R60.1
NetC40_2: C40.2 D43.3(K) R64.2 X3.3(SIO)
NetC41_2: C41.2 D43.5(K) R62.2 X3.7(RST)
NetC42_2: C42.2 D43.6(K) R63.2 X3.6(CLK)
NetLED7_A: LED7.A R57.2
NetLED8_K: LED8.K R61.2
NetR58_2: R58.2 SW1.3 SW1.4
NetR61_1: R61.1 T6.3(C)
NetSW1_1: SW1.1 SW1.2 U18.2(USB_MODE)

Not connected (* = marked no-connect by the designer): D43 1(K)*; U18 3(RESERVED)* 4(RESERVED)* 6(ADC)* 7(RESERVED)* 8(RESERVED)* 9(RESERVED)* 10(RESERVED)* 13(RESERVED)* 17(1PPS)* 22(RESERVED)* 23(RESERVED)* 26(RESERVED)* 28(RESERVED)* 32(RESERVED)* 35(RI)* 36(DCD)* 38(CTS)* 39(RTS)* 43(VDD_EXT)* 46(RESERVED)* 52(RESERVED)* 54(RESERVED)* 55(RESERVED)* 56(RESERVED)* 57(RESERVED)* 58(RESERVED)* 59(RESERVED)* 60(RESERVED)* 61(RESERVED)* 62(RESERVED)* 63(RESERVED)* 64(RESERVED)* 65(RESERVED)* 66(RESERVED)* 67(RESERVED)* 68(RESERVED)*; X3 2(NC)* 4(NC) 5(NC)*

### Layout directives
differential pair: USB_BC20_N, USB_BC20_P, USB_NB_CON_N, USB_NB_CON_P

### Notes on the sheet
- (near L4) Power
- 注意：
- 1、VBAT引脚布线宽度大于0.5mm
- 2、C172、C173、C174、C175根据电容值升序排列，最小值的电容应靠近3.3V_NB引脚，并让所有电容都尽可能地靠近3.3V_NB引脚
- RESET电路
- [15]
- (near J1) 50Ω特性阻抗
- PSM_EINT电路
- USB DOWNLOAD
- Layout: 90ohm differential pairs
- [13]
- PWRKEY电路
- 50Ω特性阻抗
- Layout Note:
- 1、USIM卡座靠近模块摆放，尽量保证外部USIM卡座信号线布线不超过200MM；
- NETLIGHT电路
- 2、SIO远离RF走线和VBAT电源线；
- 3、SIM_GND布线要短而粗，宽度不小于0.5MM，去耦电容靠近卡座摆放；
- 4、SIM_CLK和SIM_DATA信号布线不能太靠近，之间需增加地屏蔽，SIM_RST信号也需要地保护；
- 12_NB-IOT_Core
- 12
- 12/18
- V1.2
- Wangqj
- (in symbol C-TA) +

### Library data of the parts
C30 C39 = C-X7R-100nF-16V-10%-0603: Capacitor Ceramic X7R 100nF 16V 10% 0603; Tolerance: 10%; Type: X7R; Value: 100nF
C31-C35 = C-X7R-100pF-10V-20%-0603: Capacitor Ceramic X7R 100pF 10V 20% 0603; Tolerance: 20%; Type: X7R
  C31 C32 C35: Value: NM; Rating: 10V
  C33: Value: 100pF
  C34: Value: NM
C36 = C-Ceramic: Type: X7R
C37 C40 C41 = C-NP0-33pF-50V-5%-0603: Capacitor Ceramic NP0 33pF 50V 5% 0603; Type: NP0
C38 = C-4.7uF-16V-10%-0603-X5R: Capacitor Ceramic X5R 4.7uF 16V 10% 0603; Tolerance: 10%; Type: X5R; Value: 4.7uF
C42 = C-NP0-33pF-50V-5%-0603: Type: NP0
C172-C174 C176 = C-X7R-100nF-16V-10%-0603: Tolerance: 10%; Type: X7R; Value: 100nF; Rating: 16V
C175 = C-TA: Tolerance: 20%; Type: TA; Rating: 10V; Value: 1uF
D36 D37 = Diode_TVS: TVS Diode
D38 D39 = ZENER3: TVS Diode
D43 = Diode_ESD_Array: ESD Protection Diode Array; Part Number: CESDLC5V0M5
J1 J2 = ANTENNA: Generic Antenna
L4 = L-220R@100MHz-2A-25%-0603: as L8 on sheet 11_RS232_2; Rating: 2A; Value: 220R@100MHz
L16 = L-Murata-DLW21SN900SQ2-90R@100MHz-330mA-25%: Common Mode Choke High Speed 90R 330mA; Manufacturer Name: Murata; Tolerance: 25%; Rating: 330mA; Manufacturer Part No.: DLW21SN900SQ2; Value: 90R@100MHz
LED7 LED8 = LED: 0805LED绿
R57 = R-120R-63mW-5%-0603: Resistor 120 ohm 63mW 5% 0603; Rating: 63mW; Tolerance: 5%; Value: 120R
R58 R65 = R-10KR-63mW-5%-0603: Resistor 10 Kohm 63mW 5% 0603; Value: 10KR; Rating: 63mW; Tolerance: 5%
R59 R60 = R-0R-63mW-1%-0603: Resistor 0 ohm 63mW 1% 0603; Rating: 63mW; Tolerance: 1%; Value: 0R
R61 = R-1KR-63mW-5%-0603: Resistor 1 Kohm 63mW 5% 0603; Rating: 63mW; Tolerance: 5%; Value: 1K
R62-R64 = R-22R-63mW-5%-0603: Resistor 22 ohm 63mW 5% 0603; Rating: 63mW
  R62 R63: Tolerance: 5%; Value: 22R
SW1 = SW-WMF-TD-03XB: Push Button; Manufacturer Name: WMF; Rating: 50mA; Manufacturer Part No.: TD-03XB
T3-T6 = NPN_Bias_Resistor: Bias Resistor Build-in NPN Transistor
X3 = NB-IOT-CARD: NB-IOT CARD
X4 = CON-USB: USB  Connector; Manufacturer Name: FCI; Manufacturer Part No.: 73725-0110BLF; No. of ways: 4
U18 = BC20: PCB DECAL: *; BOMRemark: *; Geometry.Height: *; Manufacturer: *; Part Description: *; Part Number: *; Value: *

## Sheet 13_NB-IOT_Peripheral.SchDoc
size A3
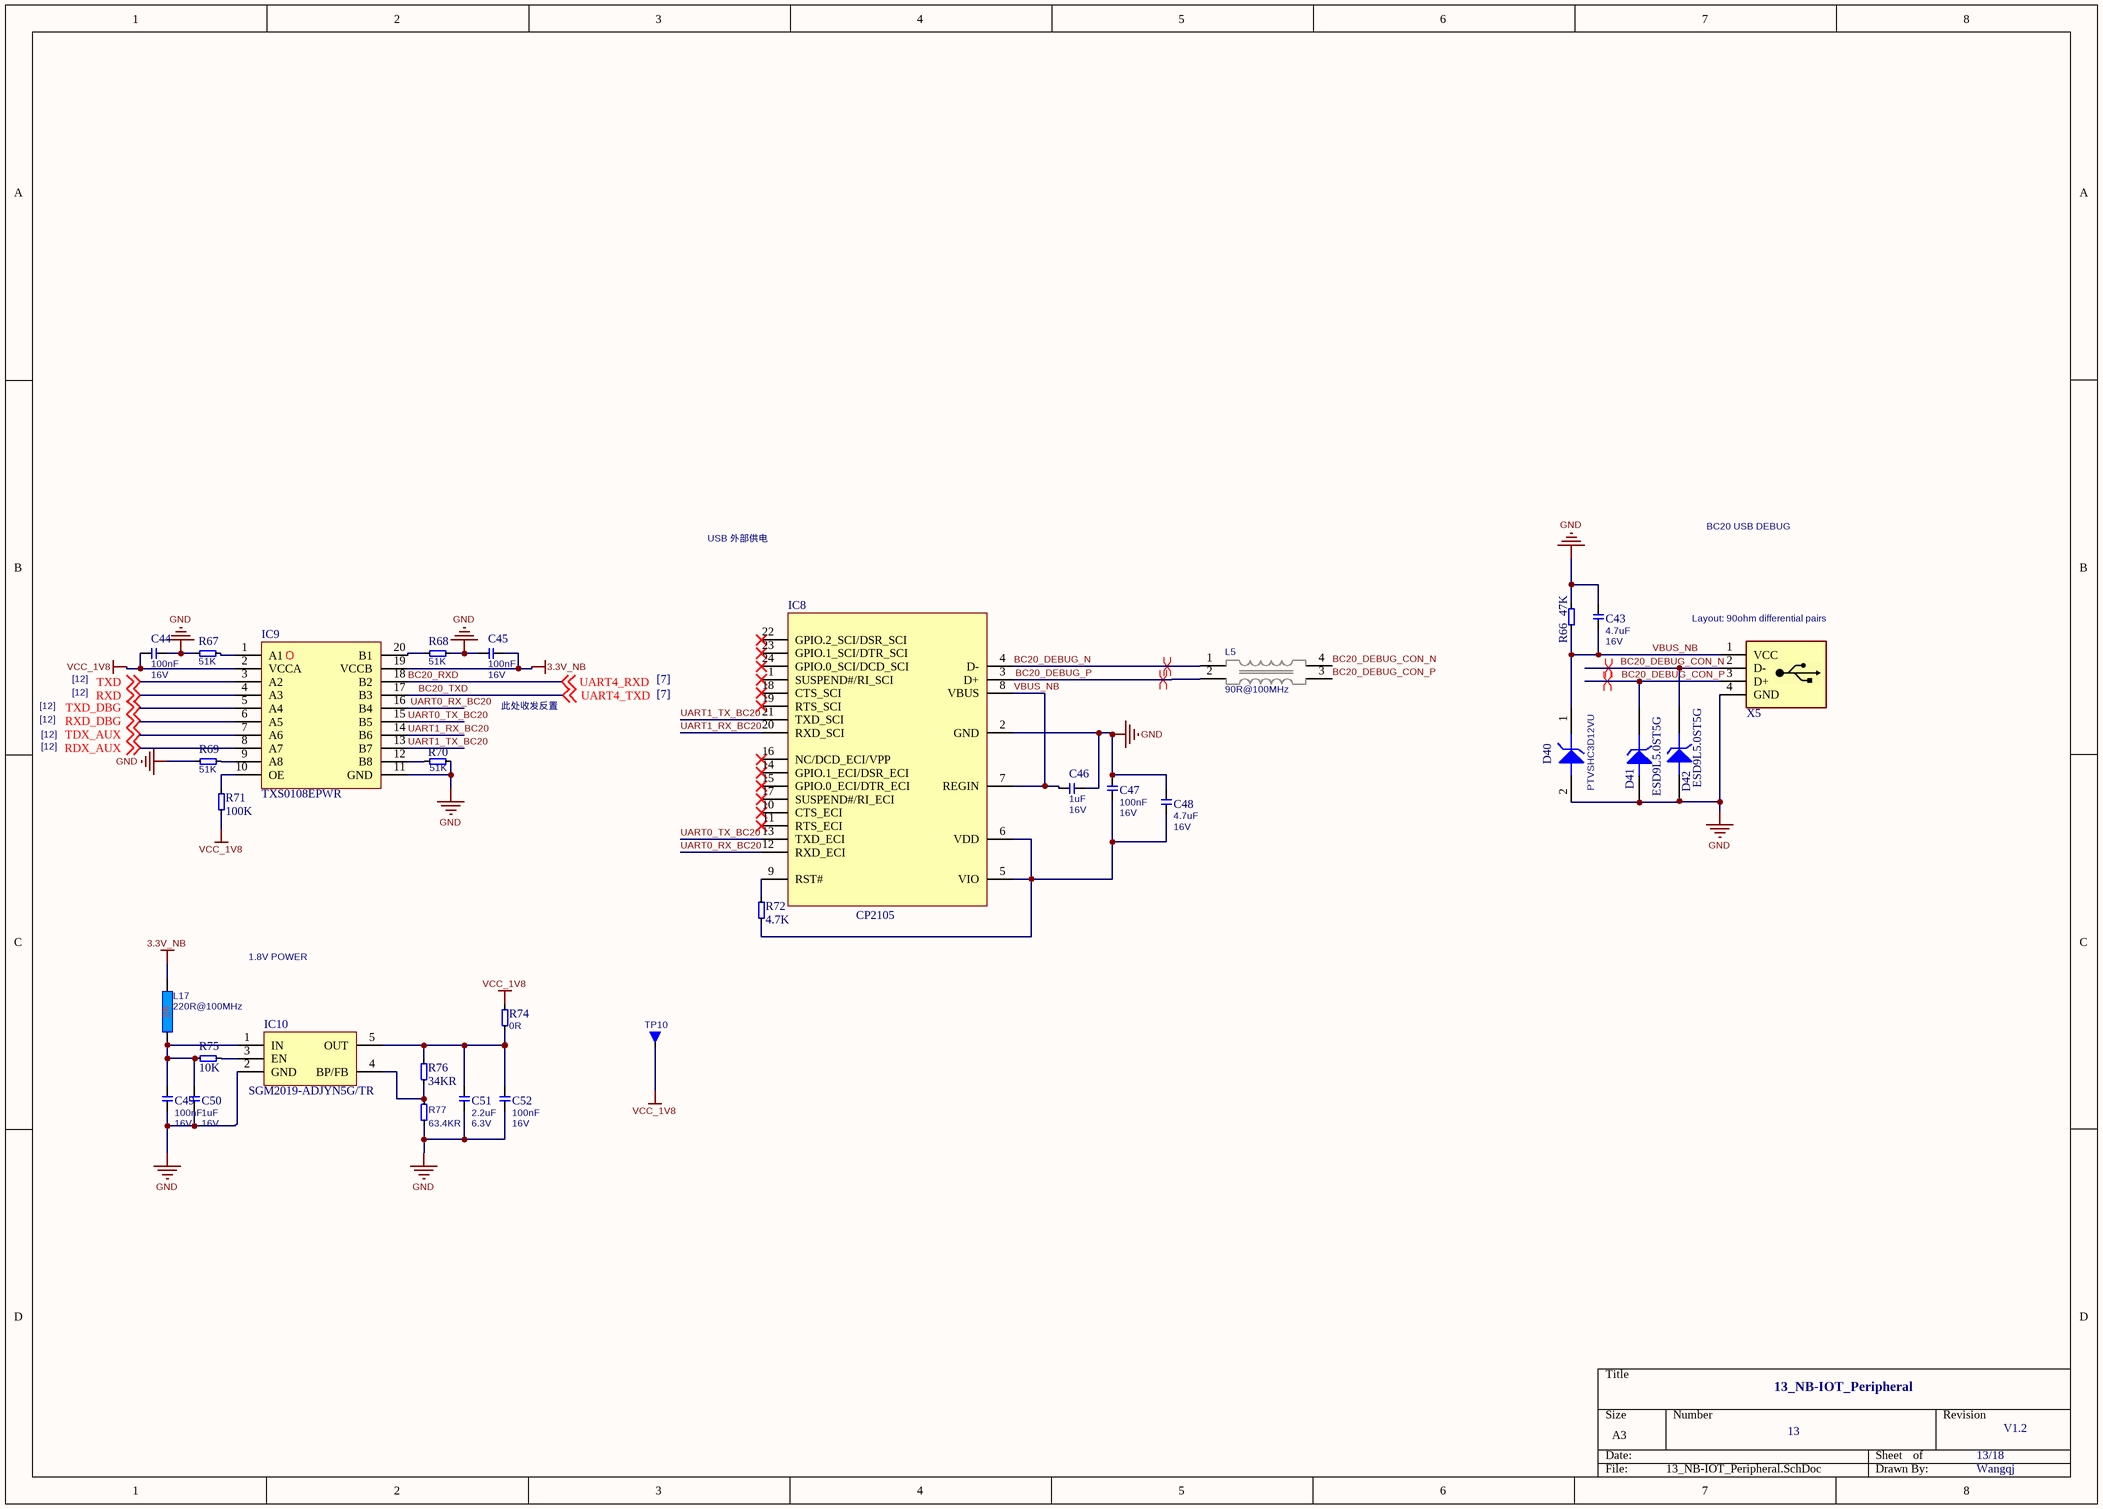
[diagram p12: 13_NB-IOT_Peripheral.SchDoc]

### Parts
C43  Rating: 16V  [T_CAPC0603X33N]  (hidden comment: 4.7uF)
C44  Rating: 16V  [T_CAPC0603X33N]  (hidden comment: 100nF)
C45  Rating: 16V  [T_CAPC0603X33N]  (hidden comment: 100nF)
C46  Rating: 16V  [T_CAPC0603X33N]  (hidden comment: 1uF)
C47  Rating: 16V  [T_CAPC0603X33N]  (hidden comment: 100nF)
C48  Rating: 16V  [T_CAPC0603X33N]  (hidden comment: 4.7uF)
C49  Rating: 16V  [T_CAPC0603X33N]  (hidden comment: 100nF)
C50  Rating: 16V  [T_CAPC0603X33N]  (hidden comment: 1uF)
C51  Rating: 6.3V  [T_CAPC0603X33N]  (hidden comment: 2.2uF)
C52  Rating: 16V  [T_CAPC0603X33N]  (hidden comment: 100nF)
D40  PTVSHC3D12VU  [LC-SOD-323]
D41  ESD9L5.0ST5G  [LC-SOD-923]
D42  ESD9L5.0ST5G  [LC-SOD-923]
IC8  CP2105  [LC-QFN-24_4x4x05P]
IC9  TXS0108EPWR  [LC-TSSOP-20]
IC10  SGM2019-ADJYN5G/TR  [LC-SOT-23-5]
L5  90R@100MHz  [T_Murata_DLW21SN900SQ2]
L17  220R@100MHz  [INDC1608X95N]
R66  47K  [T_RESC0603X30N]
R67  51K  [T_RESC0603X30N]
R68  51K  [T_RESC0603X30N]
R69  51K  [T_RESC0603X30N]
R70  51K  [T_RESC0603X30N]
R71  100K  [T_RESC0603X30N]
R72  4.7K  [t_RESC0603X30N]
R74  0R  [T_RESC0603X30N]
R75  10K  [T_RESC0603X30N]
R76  34KR  [T_RESC0603X30N]
R77  63.4KR  [T_RESC0603X30N]
TP10  Testpin  [T_TP-THT]  (value not drawn)
X5  CON-USB  [2.54*4p]  (value not drawn)

### Nets
3.3V_NB: C45.2 IC9.19(VCCB) L17.2
GND: C43.2 C44.2 C45.1 C46.2 C47.2 C48.2 C49.1 C50.1 C51.1 C52.1 D40.2(A) D41.1(A) D42.1(A) IC8.2(GND) IC9.11(GND) IC10.2(GND) R66.2 R67.1 R68.2 R69.1 R70.2 R77.1 X5.4(GND)
VCC_1V8: C44.1 IC9.2(VCCA) R71.1 R74.2 TP10.1
BC20_DEBUG_CON_N: D42.2(K) L5.4 X5.2(D-)
BC20_DEBUG_CON_P: D41.2(K) L5.3 X5.3(D+)
BC20_DEBUG_N: IC8.4(D-) L5.1
BC20_DEBUG_P: IC8.3(D+) L5.2
BC20_RXD: IC9.18(B2) ; off-sheet UART4_RXD  [also labelled UART4_RXD]
BC20_TXD: IC9.17(B3) ; off-sheet UART4_TXD  [also labelled UART4_TXD]
RDX_AUX: IC9.8(A7) ; off-sheet RDX_AUX
RXD: IC9.4(A3) ; off-sheet RXD
RXD_DBG: IC9.6(A5) ; off-sheet RXD_DBG
TDX_AUX: IC9.7(A6) ; off-sheet TDX_AUX
TXD: IC9.3(A2) ; off-sheet TXD
TXD_DBG: IC9.5(A4) ; off-sheet TXD_DBG
UART0_RX_BC20: IC8.12(RXD_ECI) IC9.16(B4)
UART0_TX_BC20: IC8.13(TXD_ECI) IC9.15(B5)
UART1_RX_BC20: IC8.20(RXD_SCI) IC9.14(B6)
UART1_TX_BC20: IC8.21(TXD_SCI) IC9.13(B7)
VBUS_NB: C43.1 C46.1 D40.1(K) IC8.7(REGIN) IC8.8(VBUS) R66.1 X5.1(VCC)
NetC47_1: C47.1 C48.1 IC8.5(VIO) IC8.6(VDD) R72.1
NetC49_2: C49.2 C50.2 IC10.1(IN) L17.1 R75.1
NetC51_2: C51.2 C52.2 IC10.5(OUT) R74.1 R76.2
NetIC8_9: IC8.9(RST#) R72.2
NetIC9_1: IC9.1(A1) R67.2
NetIC9_9: IC9.9(A8) R69.2
NetIC9_10: IC9.10(OE) R71.2
NetIC9_12: IC9.12(B8) R70.1
NetIC9_20: IC9.20(B1) R68.1
NetIC10_3: IC10.3(EN) R75.2
NetIC10_4: IC10.4(BP/FB) R76.1 R77.2

Not connected (* = marked no-connect by the designer): IC8 1(SUSPEND#/RI_SCI)* 10(CTS_ECI)* 11(RTS_ECI)* 14(GPIO.1_ECI/DSR_ECI)* 15(GPIO.0_ECI/DTR_ECI)* 16(NC/DCD_ECI/VPP)* 17(SUSPEND#/RI_ECI)* 18(CTS_SCI)* 19(RTS_SCI)* 22(GPIO.2_SCI/DSR_SCI)* 23(GPIO.1_SCI/DTR_SCI)* 24(GPIO.0_SCI/DCD_SCI)*

### Layout directives
differential pair: BC20_DEBUG_CON_N, BC20_DEBUG_CON_P, BC20_DEBUG_N, BC20_DEBUG_P

### Notes on the sheet
- USB 外部供电
- BC20 USB DEBUG
- (near X5) Layout: 90ohm differential pairs
- [12]
- 此处收发反置
- [7]
- 1.8V POWER
- 13_NB-IOT_Peripheral
- 13
- 13/18
- V1.2
- Wangqj

### Library data of the parts
C43 C48 = C-4.7uF-16V-10%-0603-X5R: Capacitor Ceramic X5R 4.7uF 16V 10% 0603; Tolerance: 10%; Type: X5R; Value: 4.7uF
C44 C45 C49 C52 = C-X7R-100nF-16V-10%-0603: Capacitor Ceramic X7R 100nF 16V 10% 0603; Tolerance: 10%; Type: X7R; Value: 100nF
C46 = C-1uF-16V-10%-0603-X5R: Capacitor Ceramic X5R 1uF 16V 10% 0603; Tolerance: 10%; Type: X5R; Value: 1uF
C47 = C-100nF-16V-10%-0603-X7R: Capacitor Ceramic X7R 100nF 16V 10% 0603; Tolerance: 10%; Type: X7R; Value: 100nF
C50 = C-X5R-1uF-16V-10%-0603: Capacitor Ceramic X5R 1uF 16V 10% 0603; Tolerance: 10%; Type: X5R; Value: 1uF
C51 = C-X5R-2.2uF-6.3V-20%-0603: Capacitor Ceramic X5R 2.2uF 6.3V 20% 0603; Tolerance: 20%; Type: X5R; Value: 2.2uF
D40 = Diode_TVS: TVS Diode
D41 D42 = ZENER3: TVS Diode
IC8 = IC-SILICON-CP2105: Single-Chip USB To Dual UART Bridge; Manufacturer Name: SILICON LABS; Manucfacturer Part NO.: CP2105
IC9 = IC-TI-TXS0108EPWR: 8-Bit Bidirectional Voltage-level Translator; Manufacturer Name: Texas Instruments; Manufacturer Part No.: TXS0108EPWR
IC10 = IC-SGMICRO-SGM2019: LDO Input: 2.5V to 5.5V Output:1.2V to 5V; Manufacturer Name: SGMICRO; Manufacturer Part No.: SGM2019-ADJYN5G/TR
L5 = L-Murata-DLW21SN900SQ2-90R@100MHz-330mA-25%: as L16 on sheet 12_NB-IOT_Core; Rating: 330mA; Manufacturer Part No.: DLW21SN900SQ2; Value: 90R@100MHz
L17 = L-220R@100MHz-2A-25%-0603: as L8 on sheet 11_RS232_2; Rating: 2A; Value: 220R@100MHz
R66 = R-47KR-63mW-5%-0603: Resistor 47 Kohm 63mW 5% 0603; Value: 47KR; Rating: 63mW; Tolerance: 5%
R67-R70 = R-51K-5%-0603: Resistor 51K ohm  5% 0603; Rating: 63mW; Tolerance: 5%; Value: 51K
R71 = R-100KR-63mW-5%-0603: Resistor 100 Kohm 63mW 5% 0603; Value: 100KR; Rating: 63mW; Tolerance: 5%
R72 = R-4.7kR-63mW-5%-0603: as R93 on sheet 10_RS232_1; Rating: 63mW; Tolerance: 5%
R74 = R-0R-63mW-1%-0603: Resistor 0 ohm 63mW 1% 0603; Rating: 63mW; Tolerance: 1%; Value: 0R
R75 = R-10KR-63mW-5%-0603: as R58 on sheet 12_NB-IOT_Core; Rating: 63mW; Tolerance: 5%
R76 = R-34KR-63mW-1%-0603: Resistor 34 Kohm 63mW 1% 0603; Rating: 63mW; Tolerance: 1%; Value: 34KR
R77 = R-63.4KR-1%-0603: Resistor 63.4 Kohm  1% 0603; Rating: 63mW; Tolerance: 1%; Value: 63.4KR
TP10 = Testpin: Testpin TH
X5 = CON-USB: as X4 on sheet 12_NB-IOT_Core

## Sheet 14_GPIOs_1.SchDoc: Apalis Evaluation Board 1.1
size A3; Organization: Toradex AG; Address1: Altsagenstrasse 5; Address2: Horw; Address3: 6048; Address4: Switzerland; DocumentNumber: 10; Revision: V1.1; SheetNumber: 10; SheetTotal: 32; PageSetup: Record=PageOptions|CenterHorizontal=True|CenterVertical=True|PrintScale=0.73|XCorrection=1.00|YCorrection=1.00|PrintKind=0|BorderSize=5000000|LeftOffset=0|BottomOffset=0|Orientation=2|PaperLength=1000|PaperWidth=1000|Scale=100|PaperSource=7|PrintQuality=-4|MediaType=1|DitherType=10|PaperKind=A4|PrintScaleMode=1
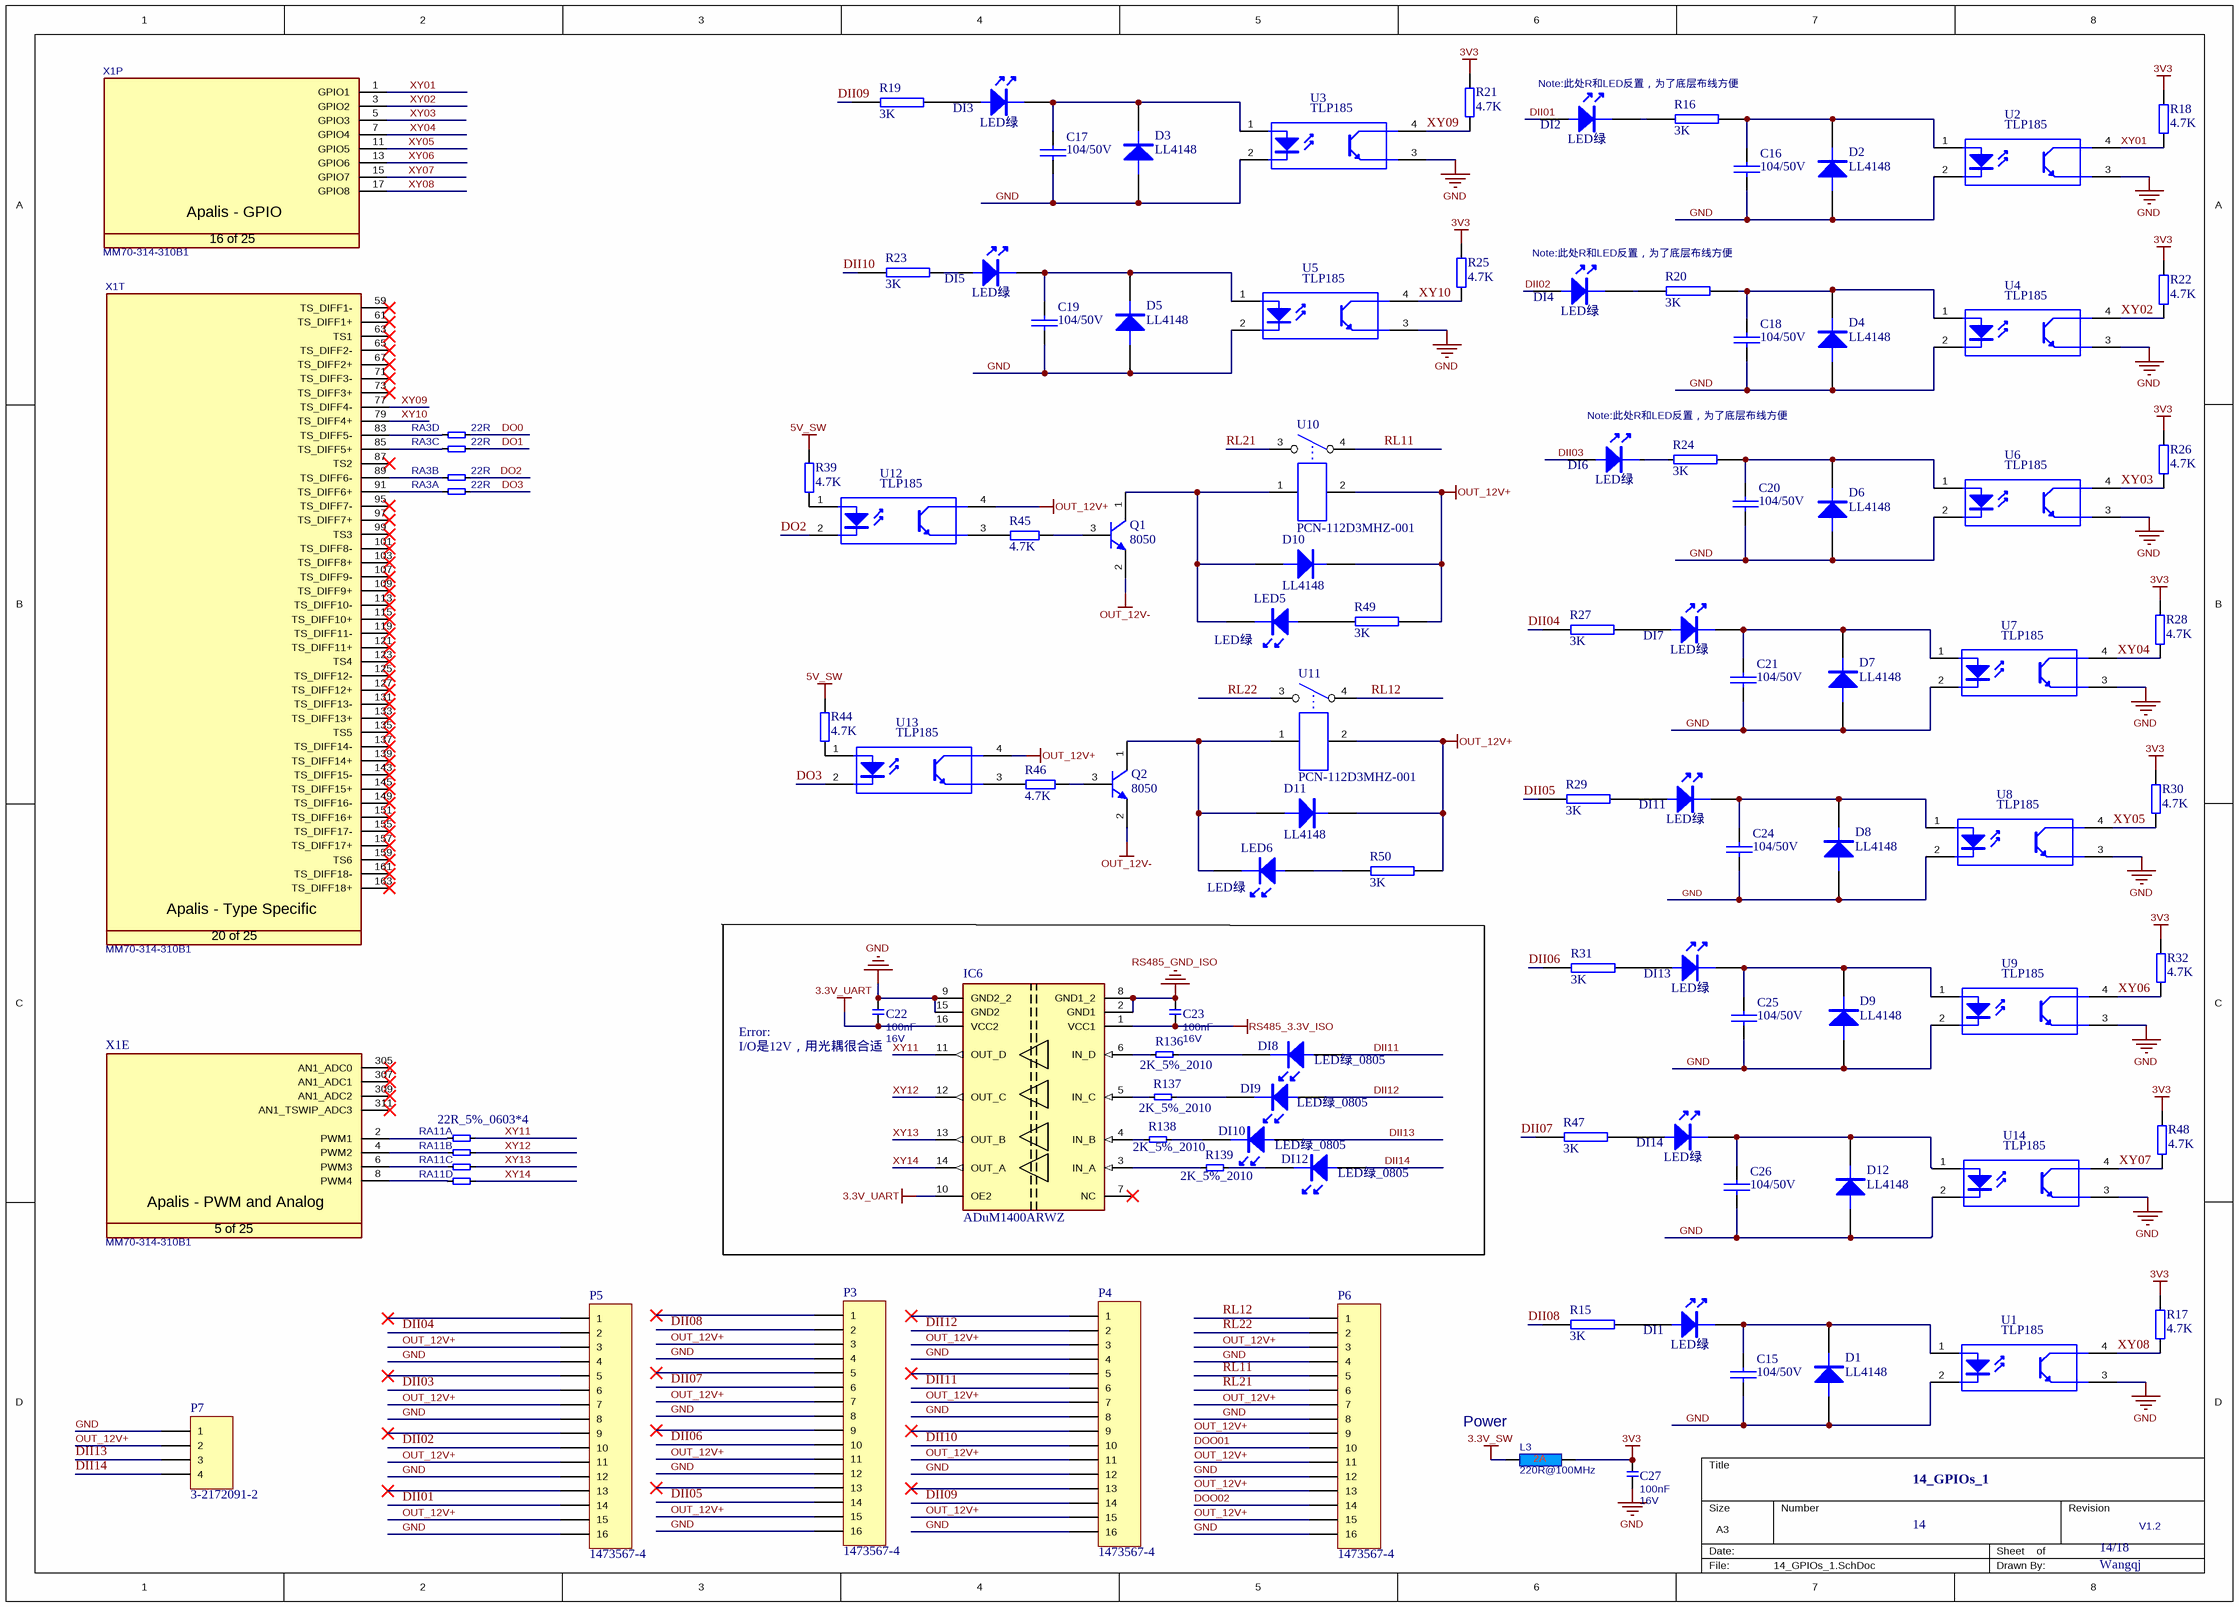
[diagram p13: 14_GPIOs_1.SchDoc]

### Parts
C15  104/50V  [0603c]
C16  104/50V  [0603c]
C17  104/50V  [0603c]
C18  104/50V  [0603c]
C19  104/50V  [0603c]
C20  104/50V  [0603c]
C21  104/50V  [0603c]
C22  Rating: 16V  [T_CAPC0603X33N]  (hidden comment: 100nF)
C23  Rating: 16V  [T_CAPC0603X33N]  (hidden comment: 100nF)
C24  104/50V  [0603c]
C25  104/50V  [0603c]
C26  104/50V  [0603c]
C27  Rating: 16V  [T_CAPC0603X33N]  (hidden comment: 100nF)
D1  LL4148  [3216]
D2  LL4148  [3216]
D3  LL4148  [3216]
D4  LL4148  [3216]
D5  LL4148  [3216]
D6  LL4148  [3216]
D7  LL4148  [3216]
D8  LL4148  [3216]
D9  LL4148  [3216]
D10  LL4148  [3216]
D11  LL4148  [3216]
D12  LL4148  [3216]
DI1  LED绿  [LC-0805_LED_S3]
DI2  LED绿  [LC-0805_LED_S3]
DI3  LED绿  [LC-0805_LED_S3]
DI4  LED绿  [LC-0805_LED_S3]
DI5  LED绿  [LC-0805_LED_S3]
DI6  LED绿  [LC-0805_LED_S3]
DI7  LED绿  [LC-0805_LED_S3]
DI8  LED绿_0805  [LC-0805_LED_S3]
DI9  LED绿_0805  [LC-0805_LED_S3]
DI10  LED绿_0805  [LC-0805_LED_S3]
DI11  LED绿  [LC-0805_LED_S3]
DI12  LED绿_0805  [LC-0805_LED_S3]
DI13  LED绿  [LC-0805_LED_S3]
DI14  LED绿  [LC-0805_LED_S3]
IC6  ADuM1400ARWZ  [T_AD_ADuM1300ARW]
L3  220R@100MHz  [INDC1608X95N]
LED5  LED绿  [LC-0805_LED_S3]
LED6  LED绿  [LC-0805_LED_S3]
P3  1473567-4  [147-4]
P4  1473567-4  [147-4]
P5  1473567-4  [147-4]
P6  1473567-4  [147-4]
P7  3-2172091-2  [M12弯角座]
Q1  8050  [SOT-23M]
Q2  8050  [SOT-23M]
R15  3K  [2010]
R16  3K  [2010]
R17  4.7K  [0603R]
R18  4.7K  [0603R]
R19  3K  [2010]
R20  3K  [2010]
R21  4.7K  [0603R]
R22  4.7K  [0603R]
R23  3K  [2010]
R24  3K  [2010]
R25  4.7K  [0603R]
R26  4.7K  [0603R]
R27  3K  [2010]
R28  4.7K  [0603R]
R29  3K  [2010]
R30  4.7K  [0603R]
R31  3K  [2010]
R32  4.7K  [0603R]
R39  4.7K  [0603R]
R44  4.7K  [0603R]
R45  4.7K  [0603R]
R46  4.7K  [0603R]
R47  3K  [2010]
R48  4.7K  [0603R]
R49  3K  [1206]
R50  3K  [1206]
R136  2K_5%_2010  [2010]
R137  2K_5%_2010  [2010]
R138  2K_5%_2010  [2010]
R139  2K_5%_2010  [2010]
RA3  22R  [T_Resistor_Array_X4]  (parts A,B,C,D of 4)
RA11  22R_5%_0603*4  [T_Resistor_Array_X4]  (parts A,B,C,D of 4)
U1  TLP185  [SO_PHT-4]
U2  TLP185  [SO_PHT-4]
U3  TLP185  [SO_PHT-4]
U4  TLP185  [SO_PHT-4]
U5  TLP185  [SO_PHT-4]
U6  TLP185  [SO_PHT-4]
U7  TLP185  [SO_PHT-4]
U8  TLP185  [SO_PHT-4]
U9  TLP185  [SO_PHT-4]
U10  PCN-112D3MHZ-001  [CRH-1C]
U11  PCN-112D3MHZ-001  [CRH-1C]
U12  TLP185  [SO_PHT-4]
U13  TLP185  [SO_PHT-4]
U14  TLP185  [SO_PHT-4]
X1  Manufacturer Part No.: MM70-314-310B1  [T_JAE_MM70-314-310B1]  (hidden comment: CON-JAE-MM70-314-310B1-314-0.5mm)  (parts E,P,T of 25)

### Nets
3.3V_SW: L3.1
3.3V_UART: C22.2 IC6.10(OE2) IC6.16(VCC2)
3V3: C27.2 L3.2 R17.2 R18.2 R21.2 R22.2 R25.2 R26.2 R28.2 R30.2 R32.2 R48.2
5V_SW: R39.1 R44.1
GND: C15.2 C16.2 C17.2 C18.2 C19.2 C20.2 C21.2 C22.1 C24.2 C25.2 C26.2 C27.1 D1.1 D2.1 D3.1 D4.1 D5.1 D6.1 D7.1 D8.1 D9.1 D12.1 IC6.9(GND2_2) IC6.15(GND2) P3.4 P3.8 P3.12 P3.16 P4.4 P4.8 P4.12 P4.16 P5.4 P5.8 P5.12 P5.16 P6.4 P6.8 P6.12 P6.16 P7.1 Q1.2(E) Q2.2(E) U1.2(K) U1.3(E) U2.2(K) U2.3(E) U3.2(K) U3.3(E) U4.2(K) U4.3(E) U5.2(K) U5.3(E) U6.2(K) U6.3(E) U7.2(K) U7.3(E) U8.2(K) U8.3(E) U9.2(K) U9.3(E) U14.2(K) U14.3(E)  [also labelled OUT_12V-]
OUT_12V+: D10.2 D11.2 P3.3 P3.7 P3.11 P3.15 P4.3 P4.7 P4.11 P4.15 P5.3 P5.7 P5.11 P5.15 P6.3 P6.7 P6.9 P6.11 P6.13 P6.15 P7.2 R49.1 R50.1 U10.2 U11.2 U12.4(C) U13.4(C)
RS485_3.3V_ISO: C23.2 IC6.1(VCC1)
RS485_GND_ISO: C23.1 IC6.2(GND1) IC6.8(GND1_2)
DII01: DI2.A P5.14
DII02: DI4.A P5.10
DII03: DI6.A P5.6
DII04: P5.2 R27.1
DII05: P3.14 R29.1
DII06: P3.10 R31.1
DII07: P3.6 R47.1
DII08: P3.2 R15.1
DII09: P4.14 R19.1
DII10: P4.10 R23.1
DII11: DI8.A P4.6
DII12: DI9.A P4.2
DII13: DI10.A P7.3
DII14: DI12.A P7.4
DO0: RA3.8
DO1: RA3.7
DO2: RA3.6 U12.2(K)
DO3: RA3.5 U13.2(K)
DOO01: P6.10
DOO02: P6.14
RL11: P6.5 U10.4
RL12: P6.1 U11.4
RL21: P6.6 U10.3
RL22: P6.2 U11.3
XY01: R18.1 U2.4(C) X1.1(GPIO1)
XY02: R22.1 U4.4(C) X1.3(GPIO2)
XY03: R26.1 U6.4(C) X1.5(GPIO3)
XY04: R28.1 U7.4(C) X1.7(GPIO4)
XY05: R30.1 U8.4(C) X1.11(GPIO5)
XY06: R32.1 U9.4(C) X1.13(GPIO6)
XY07: R48.1 U14.4(C) X1.15(GPIO7)
XY08: R17.1 U1.4(C) X1.17(GPIO8)
XY09: R21.1 U3.4(C) X1.77(TS_DIFF4-)
XY10: R25.1 U5.4(C) X1.79(TS_DIFF4+)
XY11: IC6.11(OUT_D) RA11.5
XY12: IC6.12(OUT_C) RA11.6
XY13: IC6.13(OUT_B) RA11.7
XY14: IC6.14(OUT_A) RA11.8
NetC15_1: C15.1 D1.2 DI1.K U1.1(A)
NetC16_1: C16.1 D2.2 R16.2 U2.1(A)
NetC17_1: C17.1 D3.2 DI3.K U3.1(A)
NetC18_1: C18.1 D4.2 R20.2 U4.1(A)
NetC19_1: C19.1 D5.2 DI5.K U5.1(A)
NetC20_1: C20.1 D6.2 R24.2 U6.1(A)
NetC21_1: C21.1 D7.2 DI7.K U7.1(A)
NetC24_1: C24.1 D8.2 DI11.K U8.1(A)
NetC25_1: C25.1 D9.2 DI13.K U9.1(A)
NetC26_1: C26.1 D12.2 DI14.K U14.1(A)
NetD10_1: D10.1 LED5.K Q1.1(C) U10.1
NetD11_1: D11.1 LED6.K Q2.1(C) U11.1
NetDI1_A: DI1.A R15.2
NetDI2_K: DI2.K R16.1
NetDI3_A: DI3.A R19.2
NetDI4_K: DI4.K R20.1
NetDI5_A: DI5.A R23.2
NetDI6_K: DI6.K R24.1
NetDI7_A: DI7.A R27.2
NetDI8_K: DI8.K R136.2
NetDI9_K: DI9.K R137.2
NetDI10_K: DI10.K R138.2
NetDI11_A: DI11.A R29.2
NetDI12_K: DI12.K R139.2
NetDI13_A: DI13.A R31.2
NetDI14_A: DI14.A R47.2
NetIC6_3: IC6.3(IN_A) R139.1
NetIC6_4: IC6.4(IN_B) R138.1
NetIC6_5: IC6.5(IN_C) R137.1
NetIC6_6: IC6.6(IN_D) R136.1
NetLED5_A: LED5.A R49.2
NetLED6_A: LED6.A R50.2
NetQ1_3: Q1.3(B) R45.1
NetQ2_3: Q2.3(B) R46.1
NetR39_2: R39.2 U12.1(A)
NetR44_2: R44.2 U13.1(A)
NetR45_2: R45.2 U12.3(E)
NetR46_2: R46.2 U13.3(E)
NetRA3_1: RA3.1 X1.91(TS_DIFF6+)
NetRA3_2: RA3.2 X1.89(TS_DIFF6-)
NetRA3_3: RA3.3 X1.85(TS_DIFF5+)
NetRA3_4: RA3.4 X1.83(TS_DIFF5-)
NetRA11_1: RA11.1 X1.2(PWM1)
NetRA11_2: RA11.2 X1.4(PWM2)
NetRA11_3: RA11.3 X1.6(PWM3)
NetRA11_4: RA11.4 X1.8(PWM4)

Not connected (* = marked no-connect by the designer): IC6 7(NC)*; P3 1* 5* 9* 13*; P4 1* 5* 9* 13*; P5 1* 5* 9* 13*; X1 59(TS_DIFF1-)* 61(TS_DIFF1+)* 63(TS1)* 65(TS_DIFF2-)* 67(TS_DIFF2+)* 71(TS_DIFF3-)* 73(TS_DIFF3+)* 87(TS2)* 95(TS_DIFF7-)* 97(TS_DIFF7+)* 99(TS3)* 101(TS_DIFF8-)* 103(TS_DIFF8+)* 107(TS_DIFF9-)* 109(TS_DIFF9+)* 113(TS_DIFF10-)* 115(TS_DIFF10+)* 119(TS_DIFF11-)* 121(TS_DIFF11+)* 123(TS4)* 125(TS_DIFF12-)* 127(TS_DIFF12+)* 131(TS_DIFF13-)* 133(TS_DIFF13+)* 135(TS5)* 137(TS_DIFF14-)* 139(TS_DIFF14+)* 143(TS_DIFF15-)* 145(TS_DIFF15+)* 149(TS_DIFF16-)* 151(TS_DIFF16+)* 155(TS_DIFF17-)* 157(TS_DIFF17+)* 159(TS6)* 161(TS_DIFF18-)* 163(TS_DIFF18+)* 305(AN1_ADC0)* 307(AN1_ADC1)* 309(AN1_ADC2)* 311(AN1_TSWIP_ADC3)*

### Notes on the sheet
- Note:此处R和LED反置，为了底层布线方便
- Error:
- (near C22) I/O是12V，用光耦很合适
- (near L3) Power
- 14_GPIOs_1
- 14
- 14/18
- V1.2
- Wangqj
- Title
- Size:
- Date:
- A3
- Number:
- Time:
- Revision:
- Sheet
- of
- File:
- (in symbol CON-JAE-MM70-314-310B1-314-0.5mm, part E) Apalis - PWM and Analog; 5 of 25
- (in symbol CON-JAE-MM70-314-310B1-314-0.5mm, part P) Apalis - GPIO; 16 of 25
- (in symbol CON-JAE-MM70-314-310B1-314-0.5mm, part T) Apalis - Type Specific; 20 of 25

### Library data of the parts
C15-C21 C24-C26 = CAP: 贴片电容
C22 C23 C27 = C-100nF-16V-10%-0603-X7R: Capacitor Ceramic X7R 100nF 16V 10% 0603; Tolerance: 10%; Type: X7R; Value: 100nF
D1-D9 D12 = DIODE: 贴片二极管
D10 D11 = DIODE
DI1-DI14 LED5 LED6 = LED: 0805LED绿
IC6 = IC-AD-ADuM1400ARWZ: Digital Isolator 4IN
L3 = L-220R@100MHz-2A-25%-0603: as L8 on sheet 11_RS232_2; Rating: 2A; Value: 220R@100MHz
P3 P4 = Header 16H: 泰科4P端子; LatestRevisionDate: 17-Jul-2002; LatestRevisionNote: Re-released for DXP Platform.; Publisher: Altium Limited
P5 P6 = Header 16H: 泰科4p端子; LatestRevisionDate: 17-Jul-2002; LatestRevisionNote: Re-released for DXP Platform.; Publisher: Altium Limited
P7 = Header 4H: 泰科M8端子; LatestRevisionDate: 17-Jul-2002; LatestRevisionNote: Re-released for DXP Platform.; Publisher: Altium Limited
Q1 Q2 = NPN: 贴片三极管
R15 R16 R19 R20 R23 R24 R27 R29 R31 R47 R49 R50 = RES2: 贴片电阻
R17 R18 R21 R22 R25 R26 R28 R30 R32 R39 R44-R46 R48 = RES: 贴片电阻
R136-R138 = R-2KR-500mW-5%-2010: Resistor 2 Kohm 500mW 5% 2010; Rating: 63mW; Value: 2KR; Tolerance: 5%
R139 = R-2KR-500mW-5%-2010: Rating: 63mW; Tolerance: 5%; Value: 2KR
RA3 = RA-22R-63mW-5%-1206-div: Resistor Array 22 R 63mW 5% 1206; Tolerance: 5%; Power Dissipation: 63mW; Value: 22R
RA11 = RA-22R-63mW-5%-1206-div: Tolerance: 5%; Power Dissipation: 63mW; Value: 22R
U1-U9 U12-U14 = OPTOISO1: 光耦
U10 U11 = CRH-1C-DC12V: 泰科继电器
X1 = CON-JAE-MM70-314-310B1-314-0.5mm: MXM3 Connector; Manufacturer Name: JAE; No. of ways: 314

## Sheet 15_GPIOs_2.SchDoc
size A3
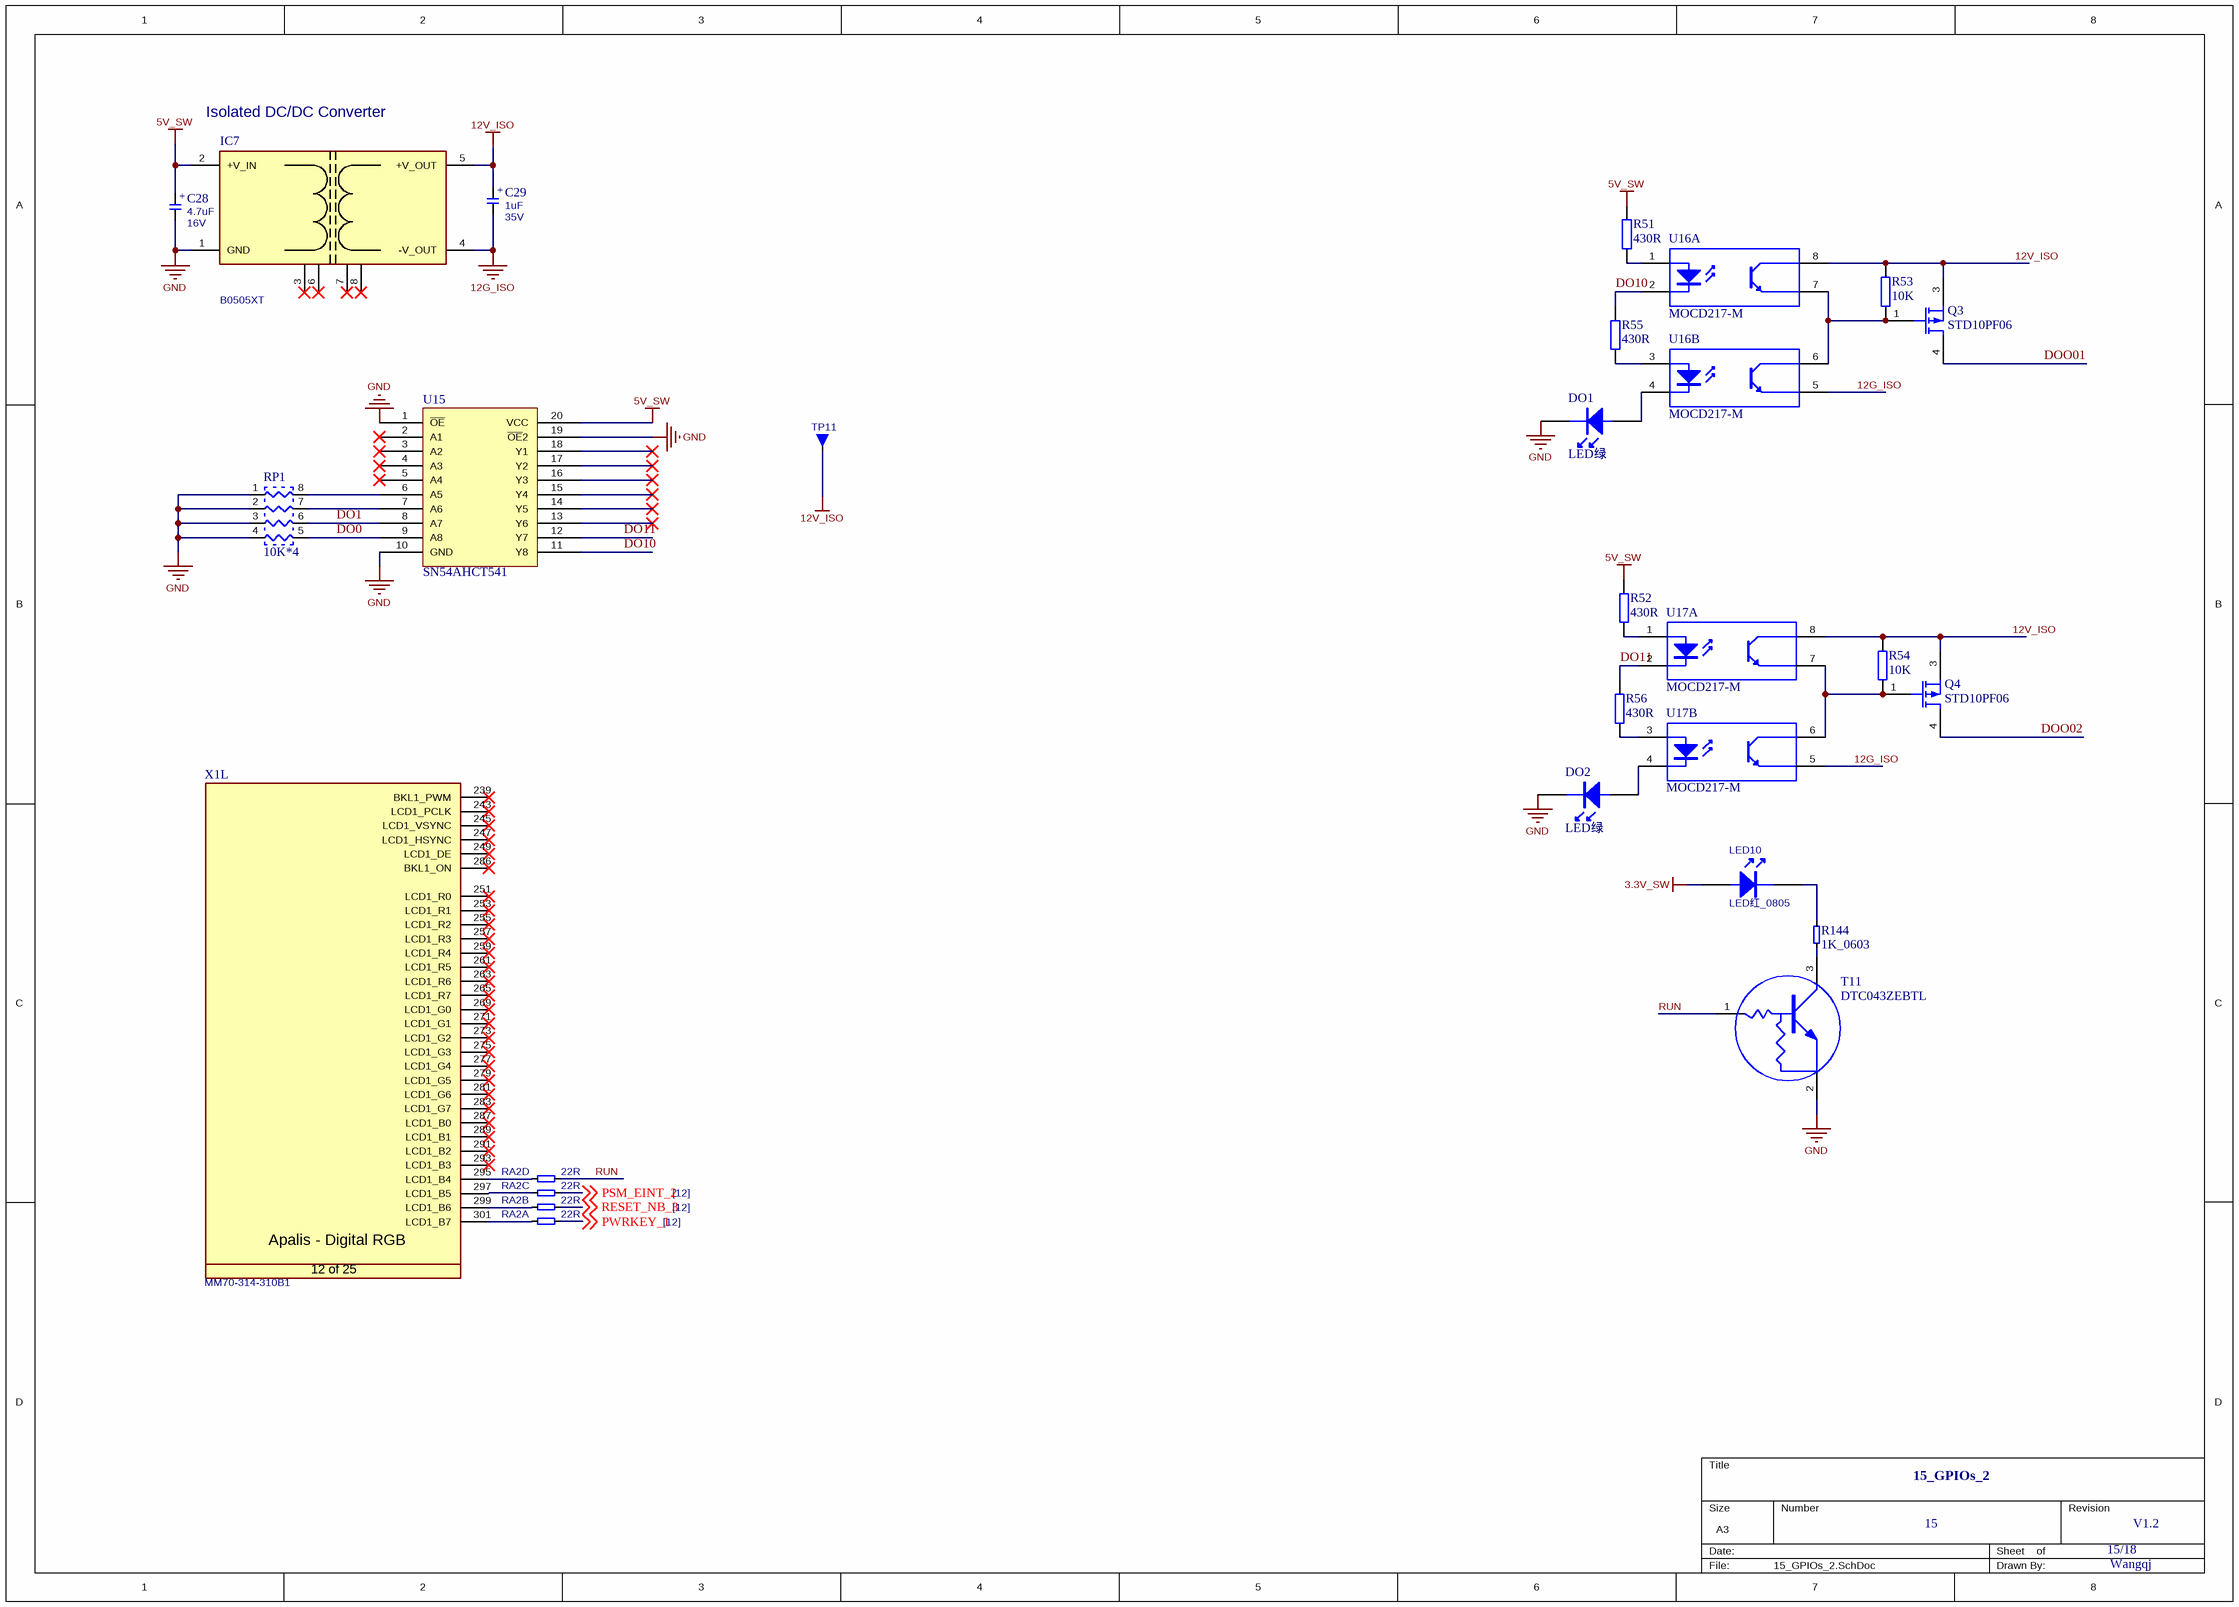
[diagram p14: 15_GPIOs_2.SchDoc]

### Parts
C28  Rating: 16V  [T_CAPMP3216X180N]  (hidden comment: 4.7uF)
C29  Rating: 35V  [T_CAPMP3216X180N]  (hidden comment: 1uF)
DO1  LED绿  [LC-0805_LED_S3]
DO2  LED绿  [LC-0805_LED_S3]
IC7  Manufacturer Part No.: B0505XT  [MORNSUN_B0305XT-1W_SMD]  (hidden comment: B0505XT-1W)
LED10  LED红_0805  [LC-0805_LED_S3]
Q3  STD10PF06  [DPAK]
Q4  STD10PF06  [DPAK]
R51  430R  [0805R]
R52  430R  [0805R]
R53  10K  [0805R]
R54  10K  [0805R]
R55  430R  [0805R]
R56  430R  [0805R]
R144  1K_0603  [T_RESC0603X30N]
RA2  22R  [T_Resistor_Array_X4]  (parts A,B,C,D of 4)
RP1  10K*4  [CN4]
T11  DTC043ZEBTL  [SOT-416FL]
TP11  Testpin  [T_TP-THT]  (value not drawn)
U15  SN54AHCT541  [TSSOP-20]
U16  MOCD217-M  [HCPL0601]  (parts A,B of 2)
U17  MOCD217-M  [HCPL0601]  (parts A,B of 2)
X1  Manufacturer Part No.: MM70-314-310B1  [T_JAE_MM70-314-310B1]  (hidden comment: CON-JAE-MM70-314-310B1-314-0.5mm)  (part L of 25)

### Nets
3.3V_SW: LED10.A
5V_SW: C28.1 IC7.2(+V_IN) R51.1 R52.1 U15.20(VCC)
12G_ISO: C29.2 IC7.4(-V_OUT) U16.5(2C) U17.5(2C)
12V_ISO: C29.1 IC7.5(+V_OUT) Q3.3(S) Q4.3(S) R53.1 R54.1 TP11.1 U16.8(1E) U17.8(1E)
GND: C28.2 DO1.K DO2.K IC7.1(GND) RP1.1(R) RP1.2(R) RP1.3(R) RP1.4(R) T11.2(E) U15.1(~{OE}) U15.10(GND) U15.19(~{OE}2)
DO0: RP1.5(R) U15.9(A8)
DO1: RP1.6(R) U15.8(A7)
DO10: R55.2 U15.11(Y8) U16.2(1-)
DO11: R56.2 U15.12(Y7) U17.2(1-)
DOO01: Q3.4(D)
DOO02: Q4.4(D)
PSM_EINT_2: RA2.7 ; off-sheet PSM_EINT_2
PWRKEY_1: RA2.5 ; off-sheet PWRKEY_1
RESET_NB_3: RA2.6 ; off-sheet RESET_NB_3
RUN: RA2.8 T11.1(B)
NetDO1_A: DO1.A U16.4(2-)
NetDO2_A: DO2.A U17.4(2-)
NetLED10_K: LED10.K R144.2
NetQ3_1: Q3.1(G) R53.2 U16.6(2E) U16.7(1C)
NetQ4_1: Q4.1(G) R54.2 U17.6(2E) U17.7(1C)
NetR51_2: R51.2 U16.1(1+)
NetR52_2: R52.2 U17.1(1+)
NetR55_1: R55.1 U16.3(2+)
NetR56_1: R56.1 U17.3(2+)
NetR144_1: R144.1 T11.3(C)
NetRA2_1: RA2.1 X1.301(LCD1_B7)
NetRA2_2: RA2.2 X1.299(LCD1_B6)
NetRA2_3: RA2.3 X1.297(LCD1_B5)
NetRA2_4: RA2.4 X1.295(LCD1_B4)
NetRP1_7: RP1.7(R) U15.7(A6)
NetRP1_8: RP1.8(R) U15.6(A5)

Not connected (* = marked no-connect by the designer): IC7 3(NC)* 6(NC)* 7(NC)* 8(NC)*; U15 2(A1)* 3(A2)* 4(A3)* 5(A4)* 13(Y6)* 14(Y5)* 15(Y4)* 16(Y3)* 17(Y2)* 18(Y1)*; X1 239(BKL1_PWM)* 243(LCD1_PCLK)* 245(LCD1_VSYNC)* 247(LCD1_HSYNC)* 249(LCD1_DE)* 251(LCD1_R0)* 253(LCD1_R1)* 255(LCD1_R2)* 257(LCD1_R3)* 259(LCD1_R4)* 261(LCD1_R5)* 263(LCD1_R6)* 265(LCD1_R7)* 269(LCD1_G0)* 271(LCD1_G1)* 273(LCD1_G2)* 275(LCD1_G3)* 277(LCD1_G4)* 279(LCD1_G5)* 281(LCD1_G6)* 283(LCD1_G7)* 286(BKL1_ON)* 287(LCD1_B0)* 289(LCD1_B1)* 291(LCD1_B2)* 293(LCD1_B3)*

### Notes on the sheet
- (near IC7) Isolated DC/DC Converter
- [12]
- 15_GPIOs_2
- 15
- 15/18
- V1.2
- Wangqj
- (in symbol C-1uF-16V-10%-3216-TA) +
- (in symbol C-4.7uF-16V-10%-3216-TA) +
- (in symbol CON-JAE-MM70-314-310B1-314-0.5mm, part L) Apalis - Digital RGB; 12 of 25

### Library data of the parts
C28 = C-4.7uF-16V-10%-3216-TA: Capacitor TA 4.7uF 16V 10% 3216; Tolerance: 10%; Type: TA; Value: 4.7uF
C29 = C-1uF-16V-10%-3216-TA: Capacitor TA 1uF 35V 20% 3216; Tolerance: 20%; Type: TA; Value: 1uF
DO1 DO2 LED10 = LED: 0805LED绿
IC7 = IC-MORNSUN-B0505XT-SMD: as IC17 on sheet 11_RS232_2
Q3 Q4 = MOSFET-P1: P-Channel MOSFET; Published: 8-Jun-2000; LatestRevisionDate: 17-Jul-2002; LatestRevisionNote: Re-released for DXP Platform.; PackageVersion: 1995/1996; PackageReference: E3; Publisher: Altium Limited; PackageDescription: TO, Flat Index; 3 In-Line, Axial Leads; Body Dia. 4.6mm; Lead Dia. 0.5 mm (max)
R51-R56 = RES2: 贴片电阻
R144 = R-1KR-63mW-5%-0603: Resistor 1 Kohm 63mW 5% 0603; Value: 1K; Rating: 63mW; Tolerance: 5%
RA2 = RA-22R-63mW-5%-1206-div: Resistor Array 22 R 63mW 5% 1206; Tolerance: 5%; Power Dissipation: 63mW; Value: 22R
RP1 = RP_0.S4: 贴片排阻; Text Field1: 20; Text Field2: 50
T11 = NPN_Bias_Resistor: Bias Resistor Build-in NPN Transistor
TP11 = Testpin: Testpin TH
U16 U17 = MOCD217
X1 = CON-JAE-MM70-314-310B1-314-0.5mm: as X1 on sheet 14_GPIOs_1

## Sheet 16_Analog&Audio.SchDoc
size A4
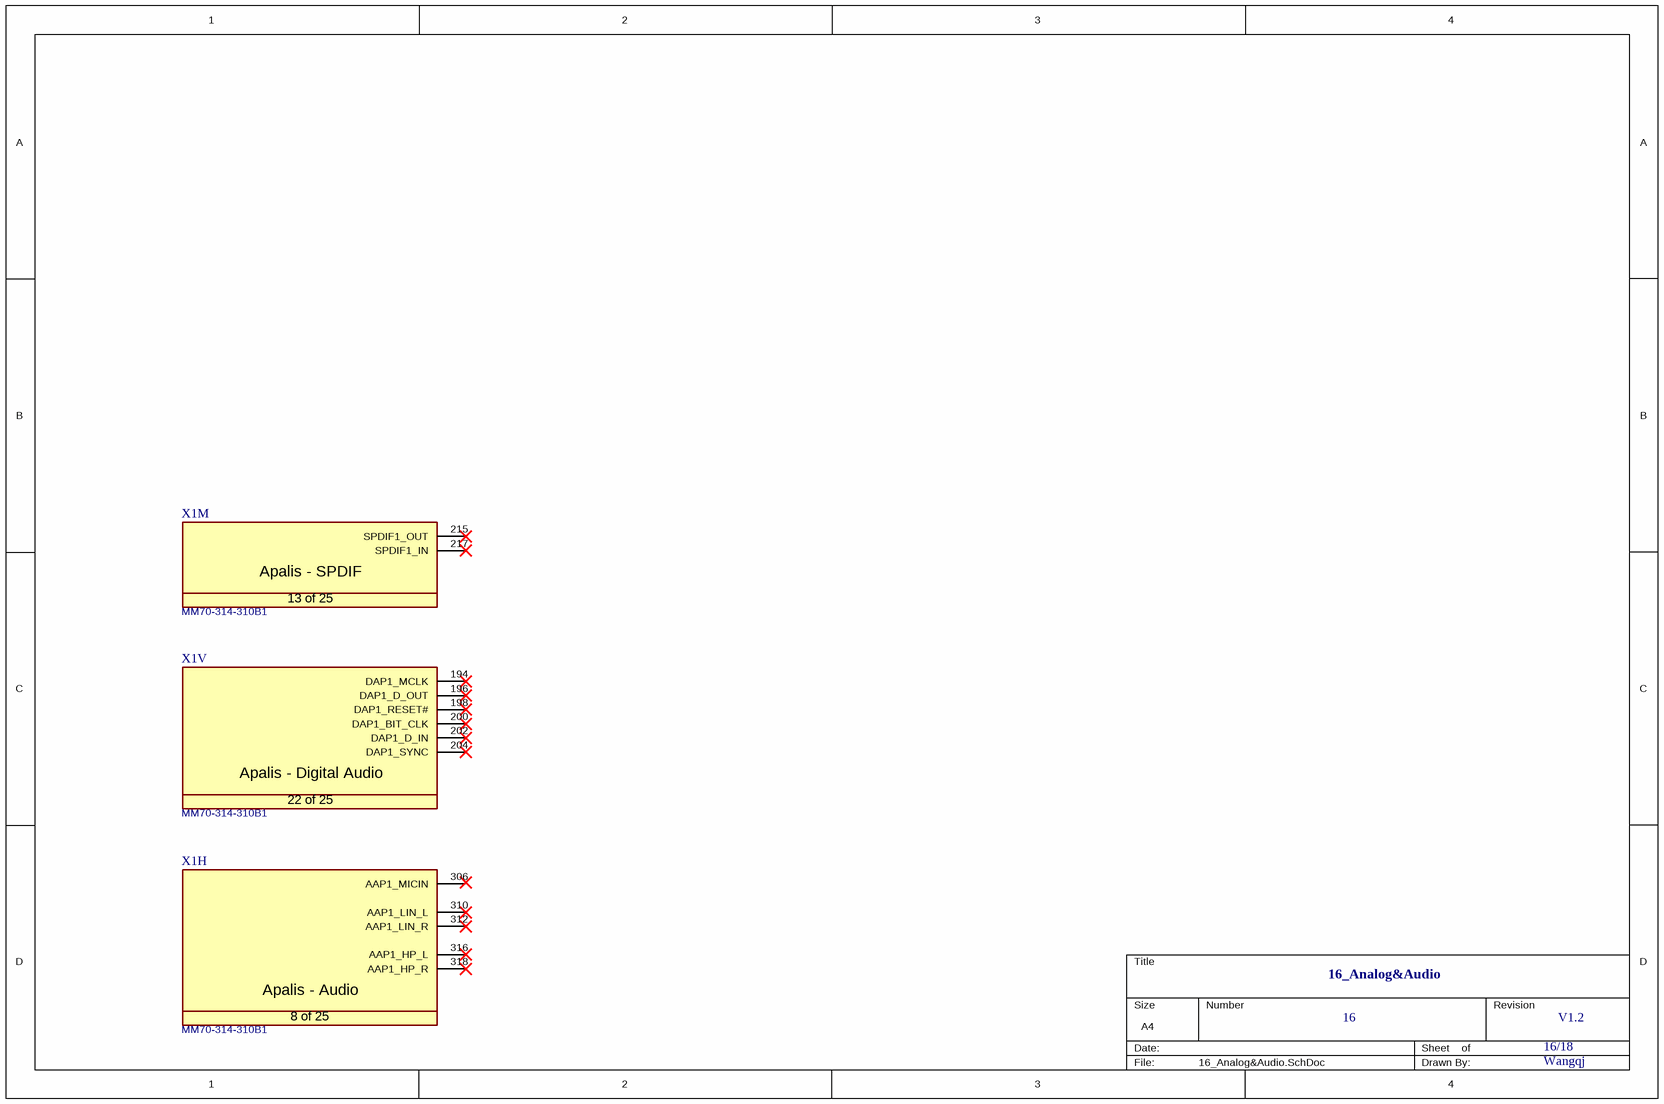
[diagram p15: 16_Analog&Audio.SchDoc]

### Parts
X1  Manufacturer Part No.: MM70-314-310B1  [T_JAE_MM70-314-310B1]  (hidden comment: CON-JAE-MM70-314-310B1-314-0.5mm)  (parts H,M,V of 25)

### Nets

Not connected (* = marked no-connect by the designer): X1 194(DAP1_MCLK)* 196(DAP1_D_OUT)* 198(DAP1_RESET#)* 200(DAP1_BIT_CLK)* 202(DAP1_D_IN)* 204(DAP1_SYNC)* 215(SPDIF1_OUT)* 217(SPDIF1_IN)* 306(AAP1_MICIN) 310(AAP1_LIN_L)* 312(AAP1_LIN_R)* 316(AAP1_HP_L)* 318(AAP1_HP_R)*

### Notes on the sheet
- 16_Analog&Audio
- 16
- 16/18
- V1.2
- Wangqj
- (in symbol CON-JAE-MM70-314-310B1-314-0.5mm, part H) Apalis - Audio; 8 of 25
- (in symbol CON-JAE-MM70-314-310B1-314-0.5mm, part M) Apalis - SPDIF; 13 of 25
- (in symbol CON-JAE-MM70-314-310B1-314-0.5mm, part V) Apalis - Digital Audio; 22 of 25

### Library data of the parts
X1 = CON-JAE-MM70-314-310B1-314-0.5mm: as X1 on sheet 14_GPIOs_1

## Sheet 17_I2C&SPI&SATA.SCHDOC: Apalis Evaluation Board 1.1
size A3; Organization: Toradex AG; Address1: Altsagenstrasse 5; Address2: Horw; Address3: 6048; Address4: Switzerland; DocumentNumber: 16; Revision: V1.1; SheetNumber: 16; SheetTotal: 32; PageSetup: Record=PageOptions|CenterHorizontal=True|CenterVertical=True|PrintScale=0.73|XCorrection=1.00|YCorrection=1.00|PrintKind=0|BorderSize=5000000|LeftOffset=0|BottomOffset=0|Orientation=2|PaperLength=1000|PaperWidth=1000|Scale=100|PaperSource=7|PrintQuality=-4|MediaType=1|DitherType=10|PaperKind=A4|PrintScaleMode=1
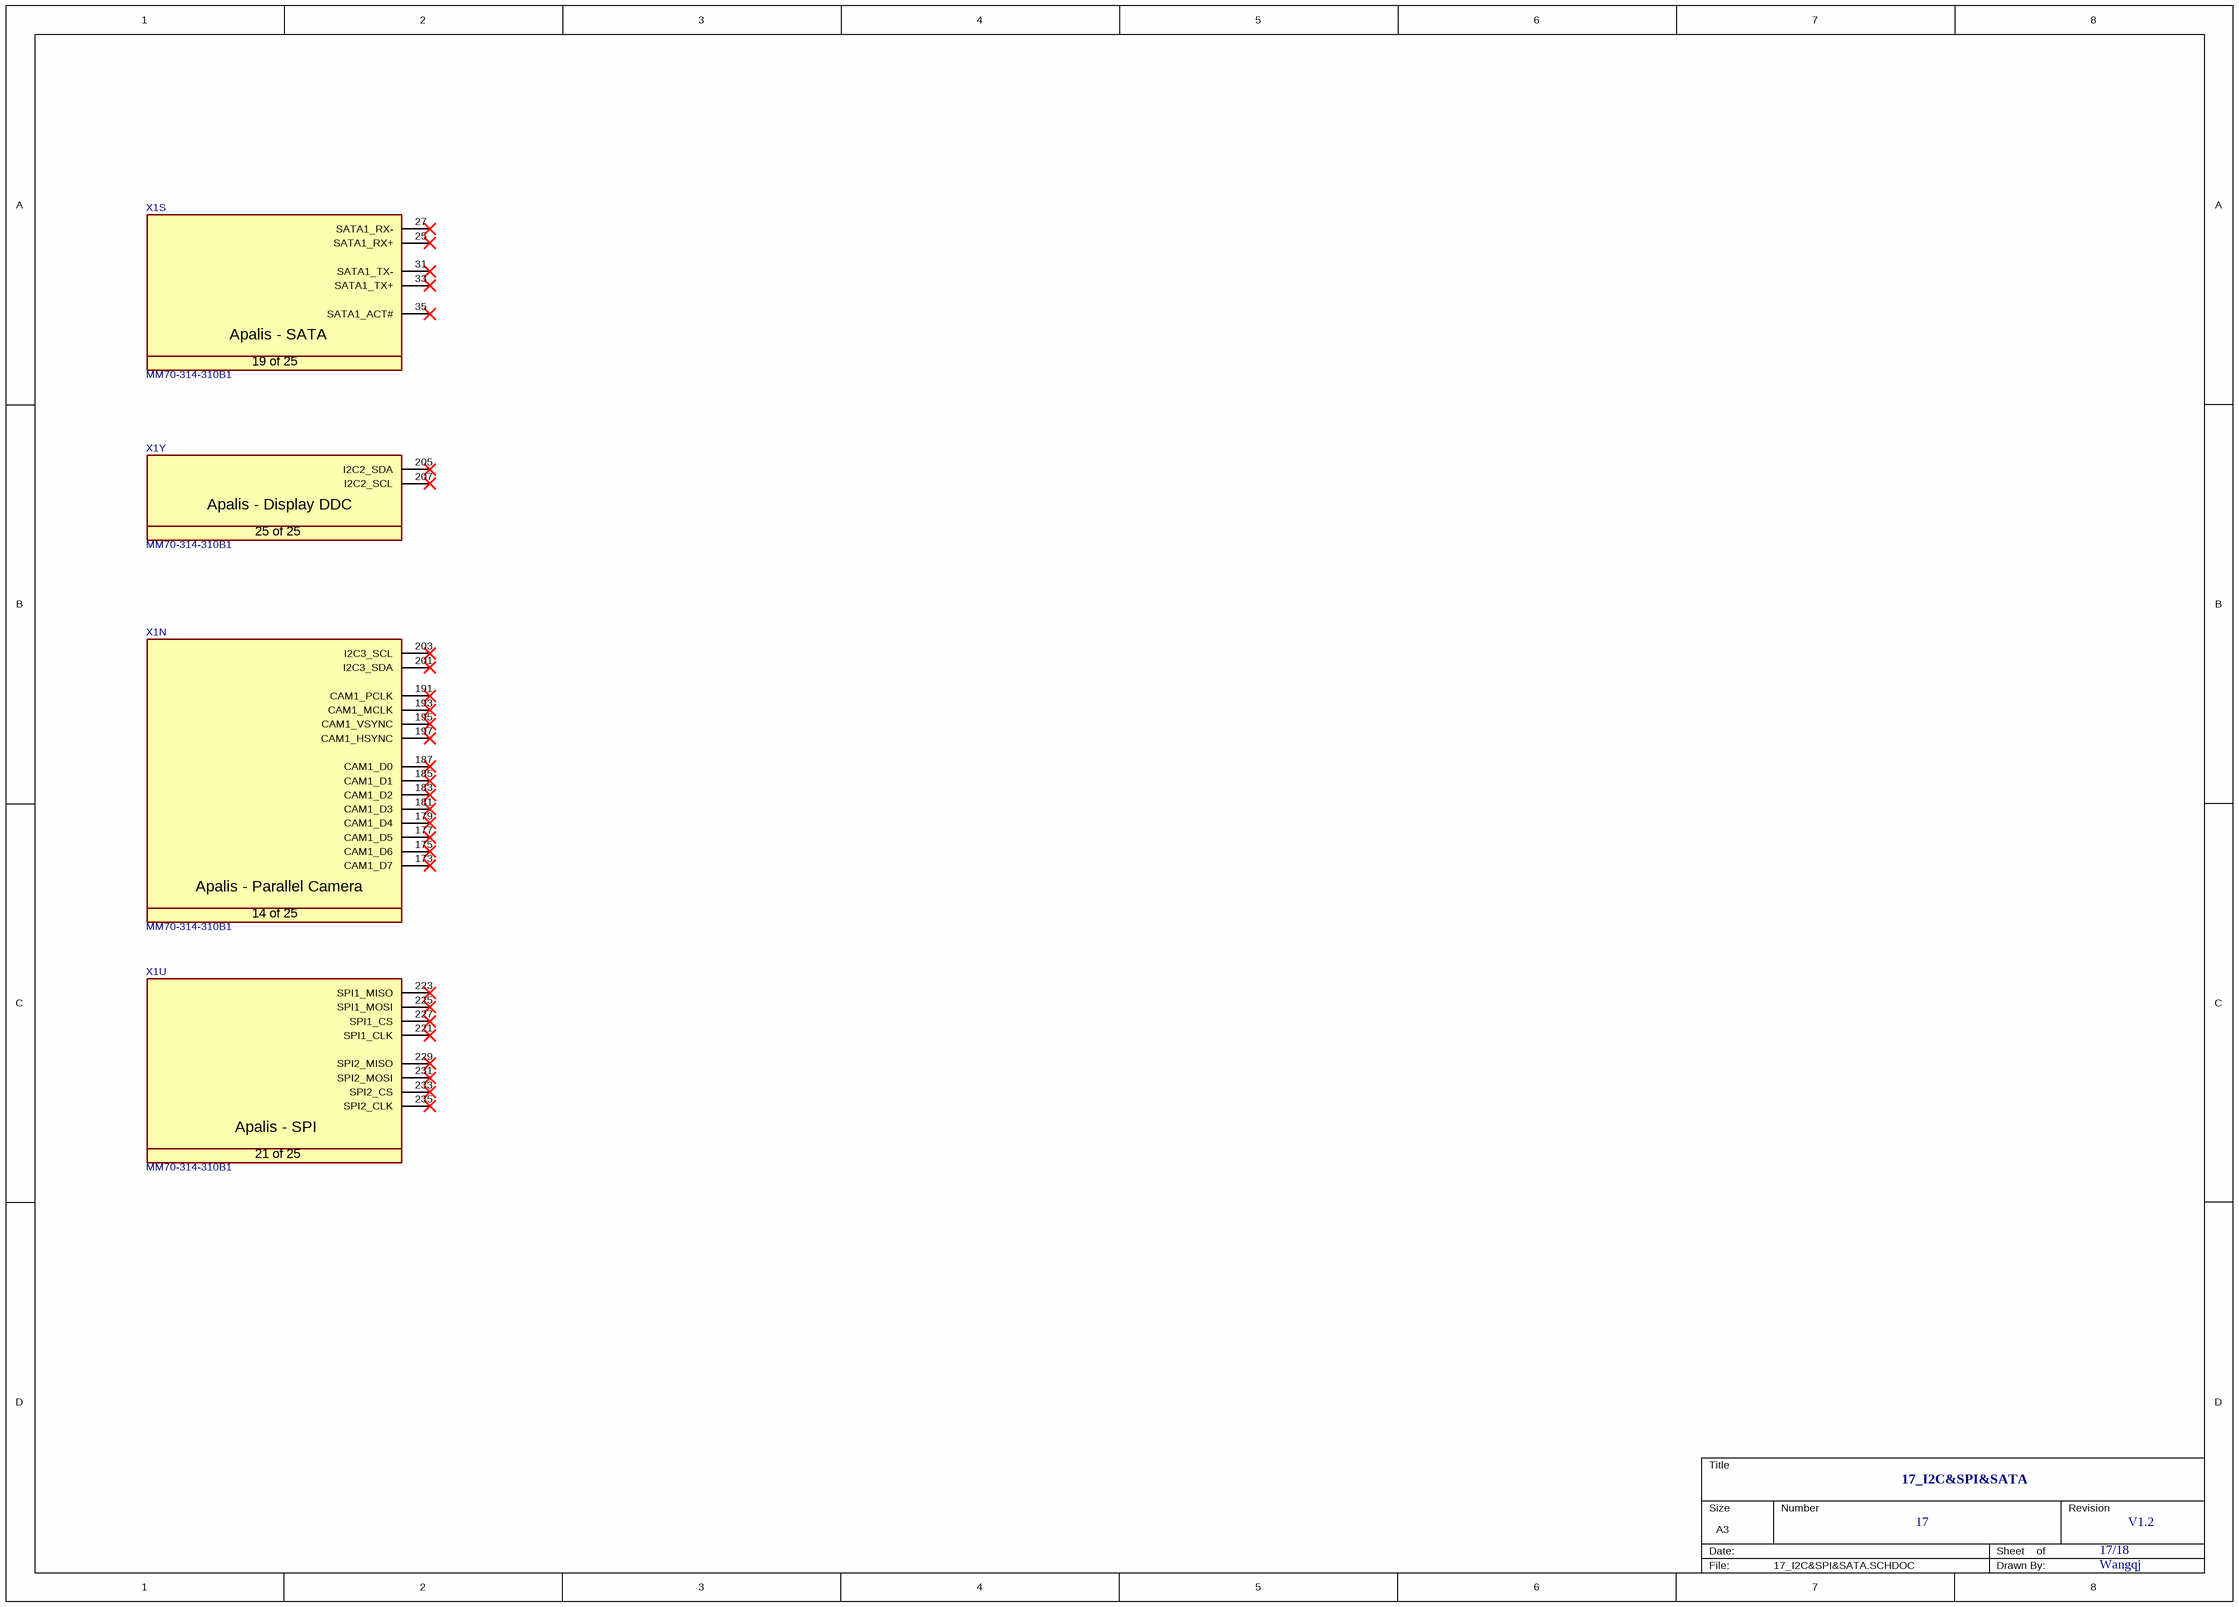
[diagram p16: 17_I2C&SPI&SATA.SCHDOC]

### Parts
X1  Manufacturer Part No.: MM70-314-310B1  [T_JAE_MM70-314-310B1]  (hidden comment: CON-JAE-MM70-314-310B1-314-0.5mm)  (parts N,S,U,Y of 25)

### Nets

Not connected (* = marked no-connect by the designer): X1 25(SATA1_RX+)* 27(SATA1_RX-)* 31(SATA1_TX-)* 33(SATA1_TX+)* 35(SATA1_ACT#)* 173(CAM1_D7)* 175(CAM1_D6)* 177(CAM1_D5)* 179(CAM1_D4)* 181(CAM1_D3)* 183(CAM1_D2)* 185(CAM1_D1)* 187(CAM1_D0)* 191(CAM1_PCLK)* 193(CAM1_MCLK)* 195(CAM1_VSYNC)* 197(CAM1_HSYNC)* 201(I2C3_SDA)* 203(I2C3_SCL)* 205(I2C2_SDA)* 207(I2C2_SCL)* 221(SPI1_CLK)* 223(SPI1_MISO)* 225(SPI1_MOSI)* 227(SPI1_CS)* 229(SPI2_MISO)* 231(SPI2_MOSI)* 233(SPI2_CS)* 235(SPI2_CLK)*

### Notes on the sheet
- 17_I2C&SPI&SATA
- 17
- 17/18
- V1.2
- Wangqj
- Title
- Size:
- Date:
- A3
- Number:
- Time:
- Revision:
- Sheet
- of
- File:
- (in symbol CON-JAE-MM70-314-310B1-314-0.5mm, part N) Apalis - Parallel Camera; 14 of 25
- (in symbol CON-JAE-MM70-314-310B1-314-0.5mm, part S) Apalis - SATA; 19 of 25
- (in symbol CON-JAE-MM70-314-310B1-314-0.5mm, part U) Apalis - SPI; 21 of 25
- (in symbol CON-JAE-MM70-314-310B1-314-0.5mm, part Y) Apalis - Display DDC; 25 of 25

### Library data of the parts
X1 = CON-JAE-MM70-314-310B1-314-0.5mm: as X1 on sheet 14_GPIOs_1

## Sheet 18_VGA.SchDoc: Apalis Evaluation Board 1.1
size A3; Organization: Toradex AG; Address1: Altsagenstrasse 5; Address2: Horw; Address3: 6048; Address4: Switzerland; DocumentNumber: 20; Revision: V1.1; SheetNumber: 20; SheetTotal: 32; PageSetup: Record=PageOptions|CenterHorizontal=True|CenterVertical=True|PrintScale=0.73|XCorrection=1.00|YCorrection=1.00|PrintKind=0|BorderSize=5000000|LeftOffset=0|BottomOffset=0|Orientation=2|PaperLength=1000|PaperWidth=1000|Scale=100|PaperSource=7|PrintQuality=-4|MediaType=1|DitherType=10|PaperKind=A4|PrintScaleMode=1
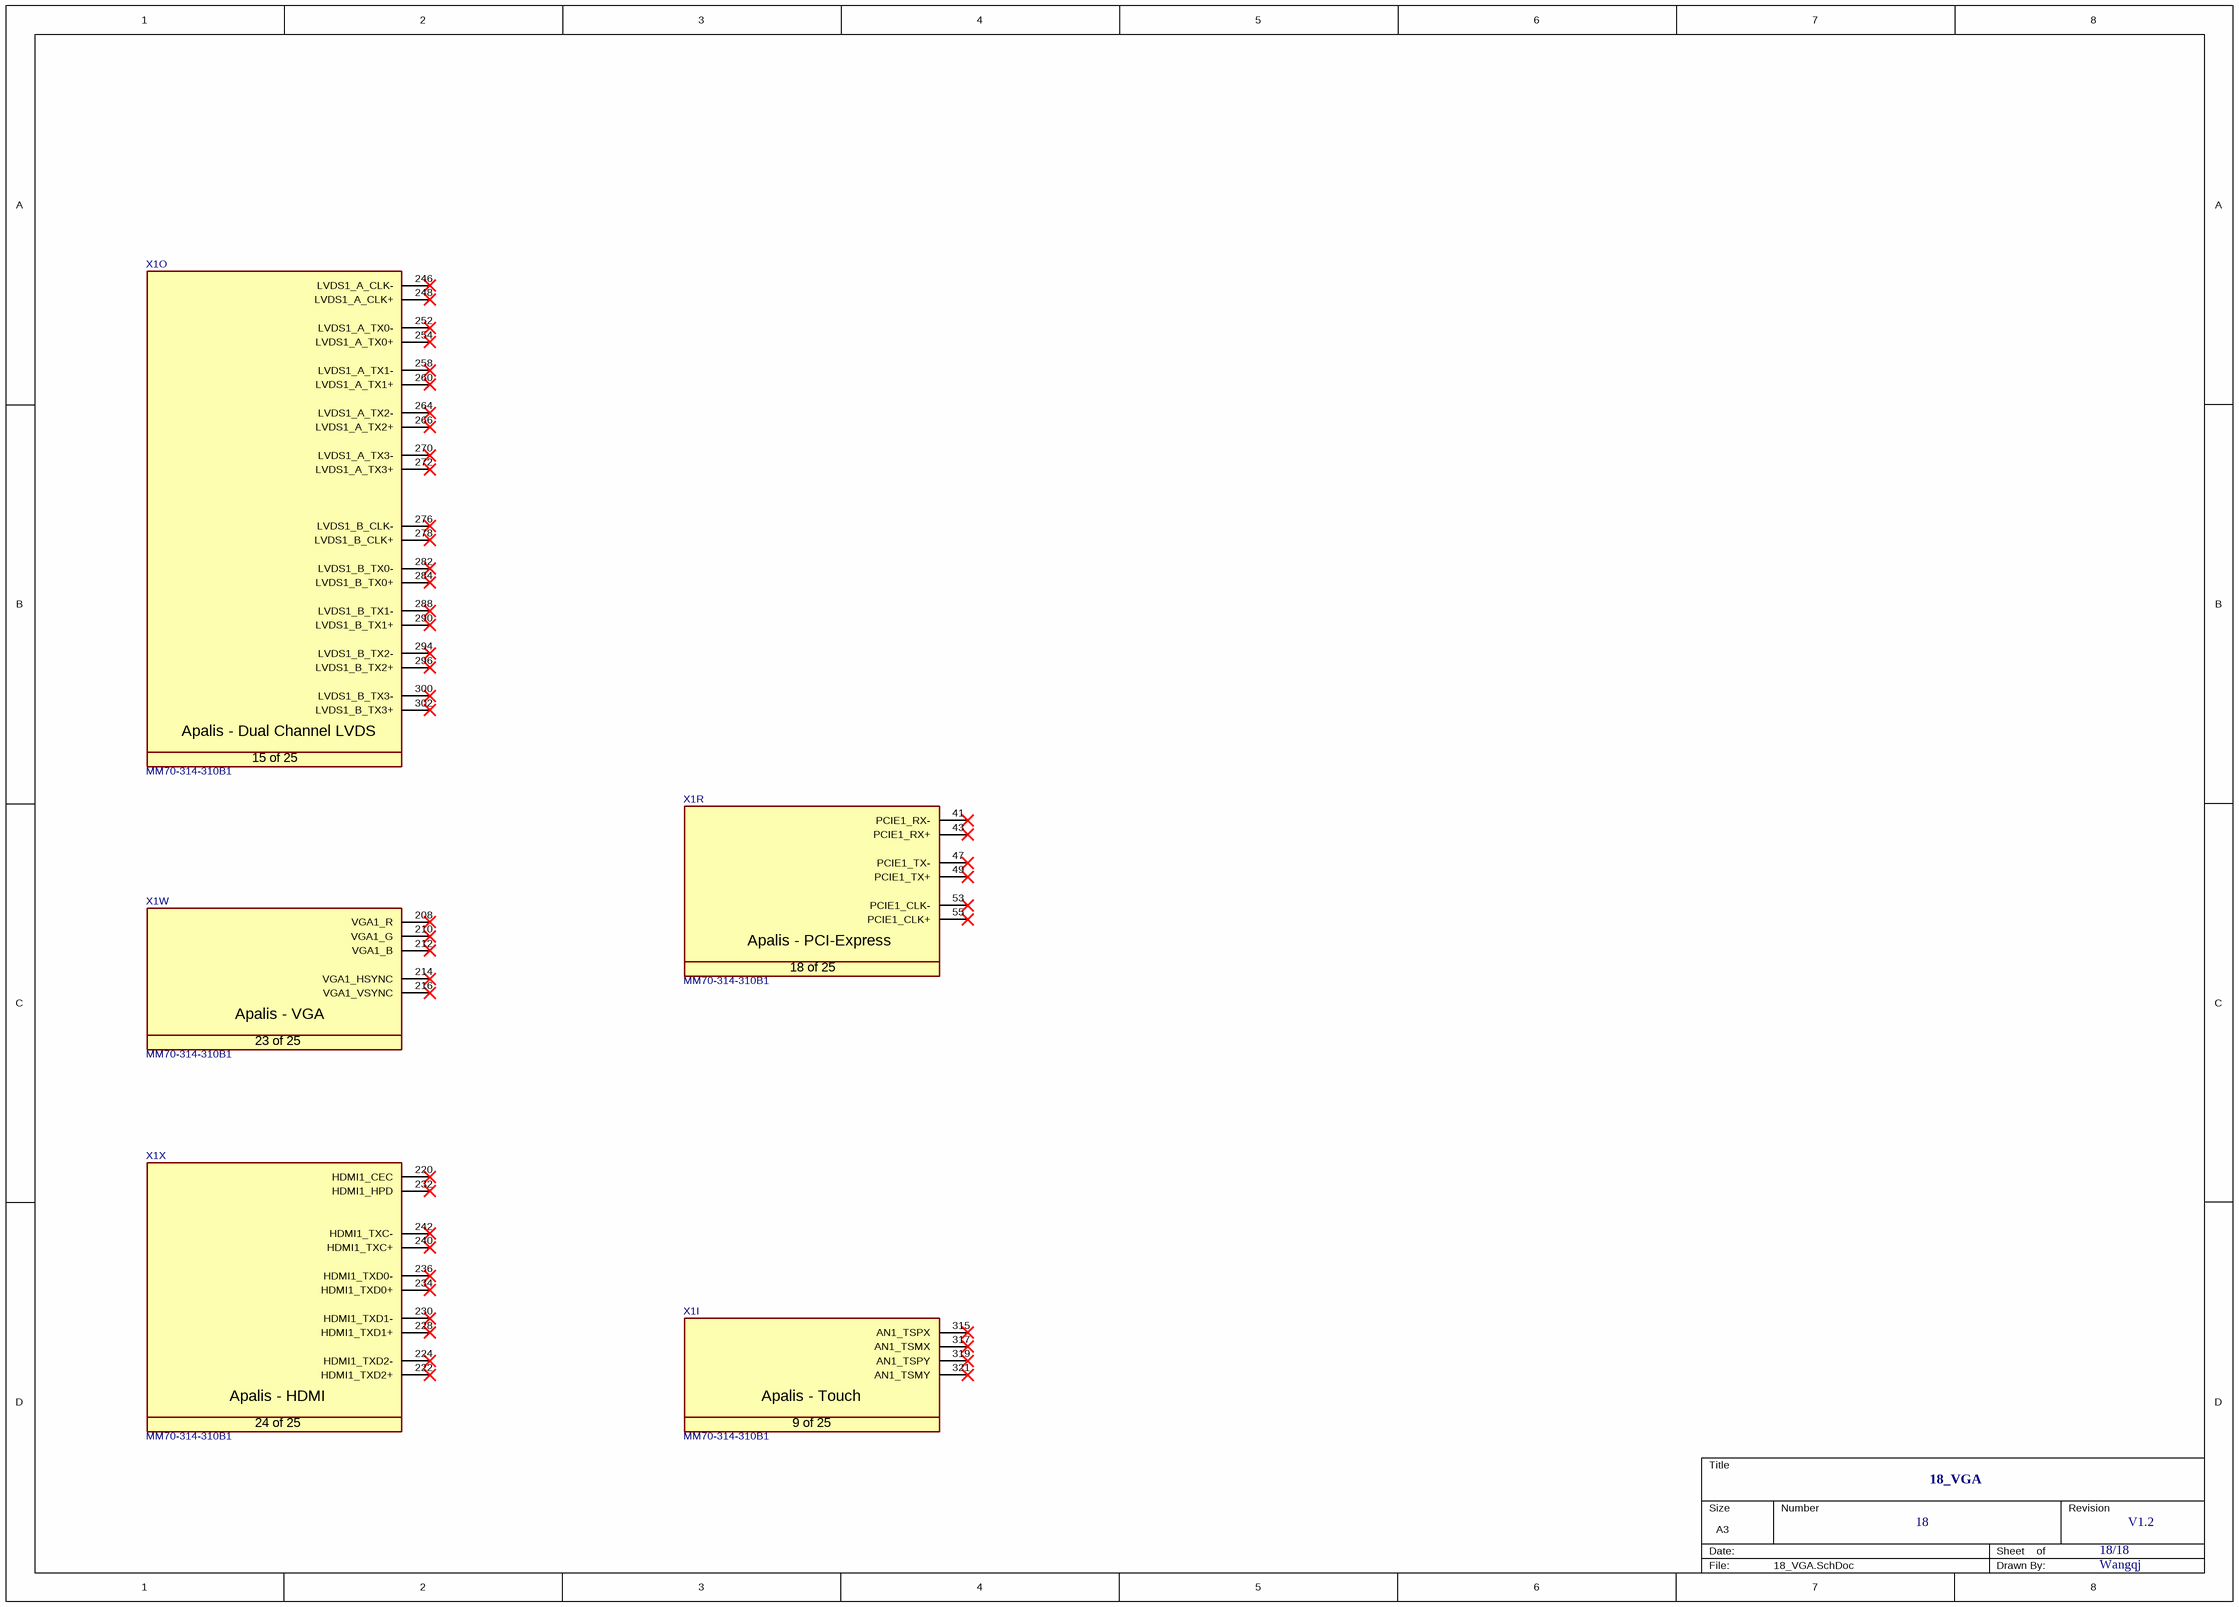
[diagram p17: 18_VGA.SchDoc]

### Parts
X1  Manufacturer Part No.: MM70-314-310B1  [T_JAE_MM70-314-310B1]  (hidden comment: CON-JAE-MM70-314-310B1-314-0.5mm)  (parts I,O,R,W,X of 25)

### Nets

Not connected (* = marked no-connect by the designer): X1 41(PCIE1_RX-)* 43(PCIE1_RX+)* 47(PCIE1_TX-)* 49(PCIE1_TX+)* 53(PCIE1_CLK-)* 55(PCIE1_CLK+)* 208(VGA1_R)* 210(VGA1_G)* 212(VGA1_B)* 214(VGA1_HSYNC)* 216(VGA1_VSYNC)* 220(HDMI1_CEC)* 222(HDMI1_TXD2+)* 224(HDMI1_TXD2-)* 228(HDMI1_TXD1+)* 230(HDMI1_TXD1-)* 232(HDMI1_HPD)* 234(HDMI1_TXD0+)* 236(HDMI1_TXD0-)* 240(HDMI1_TXC+)* 242(HDMI1_TXC-)* 246(LVDS1_A_CLK-)* 248(LVDS1_A_CLK+)* 252(LVDS1_A_TX0-)* 254(LVDS1_A_TX0+)* 258(LVDS1_A_TX1-)* 260(LVDS1_A_TX1+)* 264(LVDS1_A_TX2-)* 266(LVDS1_A_TX2+)* 270(LVDS1_A_TX3-)* 272(LVDS1_A_TX3+)* 276(LVDS1_B_CLK-)* 278(LVDS1_B_CLK+)* 282(LVDS1_B_TX0-)* 284(LVDS1_B_TX0+)* 288(LVDS1_B_TX1-)* 290(LVDS1_B_TX1+)* 294(LVDS1_B_TX2-)* 296(LVDS1_B_TX2+)* 300(LVDS1_B_TX3-)* 302(LVDS1_B_TX3+)* 315(AN1_TSPX)* 317(AN1_TSMX)* 319(AN1_TSPY)* 321(AN1_TSMY)*

### Notes on the sheet
- 18_VGA
- 18
- 18/18
- V1.2
- Wangqj
- Title
- Size:
- Date:
- A3
- Number:
- Time:
- Revision:
- Sheet
- of
- File:
- (in symbol CON-JAE-MM70-314-310B1-314-0.5mm, part I) Apalis - Touch; 9 of 25
- (in symbol CON-JAE-MM70-314-310B1-314-0.5mm, part O) Apalis - Dual Channel LVDS; 15 of 25
- (in symbol CON-JAE-MM70-314-310B1-314-0.5mm, part R) Apalis - PCI-Express; 18 of 25
- (in symbol CON-JAE-MM70-314-310B1-314-0.5mm, part W) Apalis - VGA; 23 of 25
- (in symbol CON-JAE-MM70-314-310B1-314-0.5mm, part X) Apalis - HDMI; 24 of 25

### Library data of the parts
X1 = CON-JAE-MM70-314-310B1-314-0.5mm: as X1 on sheet 14_GPIOs_1

## Nets that join several sheets
3.3V: 1_Power_Supply (8 pins), 2_Power_Switch (12 pins)
3.3V_NB: 12_NB-IOT_Core (13 pins), 13_NB-IOT_Peripheral (C45.2 IC9.19 L17.2)
3.3V_RS232: 7_UART&RS485 (C137.2 IC24.16), 10_RS232_1 (18 pins), 11_RS232_2 (22 pins)
3.3V_SW: 1_Power_Supply (R79.1 TP7.1), 2_Power_Switch (5 pins), 3_RTC (R96.2 R98.2 R99.2 R100.2), 4_SDCard (11 pins), 5_Ethernet (X2.14 X2.16), 6_CAN (L1.1), 7_UART&RS485 (L10.1), 8_USB_Hub (14 pins), 11_RS232_2 (L8.1), 12_NB-IOT_Core (L4.1), 14_GPIOs_1 (L3.1), 15_GPIOs_2 (LED10.A)
3.3V_UART: 7_UART&RS485 (10 pins), 14_GPIOs_1 (C22.2 IC6.10 IC6.16)
5V_SW: 1_Power_Supply (R80.1 TP8.1), 2_Power_Switch (C84.1 C86.1 IC5.1 L20.2), 9_USB_Connectors (6 pins), 14_GPIOs_1 (R39.1 R44.1), 15_GPIOs_2 (5 pins)
GND: 1_Power_Supply (60 pins), 2_Power_Switch (34 pins), 3_RTC (7 pins), 4_SDCard (7 pins), 5_Ethernet (9 pins), 6_CAN (10 pins), 7_UART&RS485 (20 pins), 8_USB_Hub (22 pins), 9_USB_Connectors (13 pins), 10_RS232_1 (16 pins), 11_RS232_2 (19 pins), 12_NB-IOT_Core (44 pins), 13_NB-IOT_Peripheral (23 pins), 14_GPIOs_1 (63 pins), 15_GPIOs_2 (12 pins)
OUT_12V+: 1_Power_Supply (9 pins), 2_Power_Switch (12 pins), 7_UART&RS485 (P15.3 P15.7 P15.11 P15.15), 9_USB_Connectors (P16.3), 14_GPIOs_1 (27 pins)
RS232_5V_ISO: 10_RS232_1 (14 pins), 11_RS232_2 (16 pins)
RS232_GND_ISO: 10_RS232_1 (18 pins), 11_RS232_2 (20 pins)
RS485_3.3V_ISO: 7_UART&RS485 (15 pins), 14_GPIOs_1 (C23.2 IC6.1)
RS485_GND_ISO: 7_UART&RS485 (17 pins), 14_GPIOs_1 (C23.1 IC6.2 IC6.8)
SHIELD: 5_Ethernet (C165.2 R134.2 X2.S1 X2.S2), 6_CAN (8 pins), 7_UART&RS485 (C169.2 P14.S1 P14.S2 R141.2)
A1: 7_UART&RS485 (5 pins), 9_USB_Connectors (P16.1)
B1: 7_UART&RS485 (5 pins), 9_USB_Connectors (P16.2)
BC20_RXD: 7_UART&RS485 (RA10.8), 13_NB-IOT_Peripheral (IC9.18)
BC20_TXD: 7_UART&RS485 (RA10.7), 13_NB-IOT_Peripheral (IC9.17)
DO0: 14_GPIOs_1 (RA3.8), 15_GPIOs_2 (RP1.5 U15.9)
DO1: 14_GPIOs_1 (RA3.7), 15_GPIOs_2 (RP1.6 U15.8)
DOO01: 14_GPIOs_1 (P6.10), 15_GPIOs_2 (Q3.4)
DOO02: 14_GPIOs_1 (P6.14), 15_GPIOs_2 (Q4.4)
MXM3_26: 2_Power_Switch (RA4.7 T10.2), 8_USB_Hub (IC32.26)
PSM_EINT_2: 12_NB-IOT_Core (T4.1), 15_GPIOs_2 (RA2.7)
PWRKEY_1: 12_NB-IOT_Core (T5.1), 15_GPIOs_2 (RA2.5)
RDX_AUX: 12_NB-IOT_Core (U18.24), 13_NB-IOT_Peripheral (IC9.8)
RESET_NB_3: 12_NB-IOT_Core (T3.1), 15_GPIOs_2 (RA2.6)
RXD: 12_NB-IOT_Core (U18.33), 13_NB-IOT_Peripheral (IC9.4)
RXD_DBG: 12_NB-IOT_Core (U18.30), 13_NB-IOT_Peripheral (IC9.6)
TDX_AUX: 12_NB-IOT_Core (U18.25), 13_NB-IOT_Peripheral (IC9.7)
TXD: 12_NB-IOT_Core (U18.34), 13_NB-IOT_Peripheral (IC9.3)
TXD_DBG: 12_NB-IOT_Core (U18.29), 13_NB-IOT_Peripheral (IC9.5)
USBH2B_D_N: 8_USB_Hub (IC32.3), 9_USB_Connectors (L13.2)
USBH2B_D_P: 8_USB_Hub (IC32.4), 9_USB_Connectors (L13.1)
USBH2C_D_N: 8_USB_Hub (IC32.6), 9_USB_Connectors (L11.2)
USBH2C_D_P: 8_USB_Hub (IC32.7), 9_USB_Connectors (L11.1)
USBH2D_D_N: 8_USB_Hub (IC32.8), 9_USB_Connectors (L15.2)
USBH2D_D_P: 8_USB_Hub (IC32.9), 9_USB_Connectors (L15.1)
USBH3_D_N: 8_USB_Hub (X1.88), 11_RS232_2 (IC18.63)
USBH3_D_P: 8_USB_Hub (X1.86), 11_RS232_2 (IC18.62)
USBH4_D_N: 8_USB_Hub (X1.100), 10_RS232_1 (IC12.63)
USBH4_D_P: 8_USB_Hub (X1.98), 10_RS232_1 (IC12.62)